# Altium project LPL_Control_board_Rev3.PrjPcb (part 1 of 2)
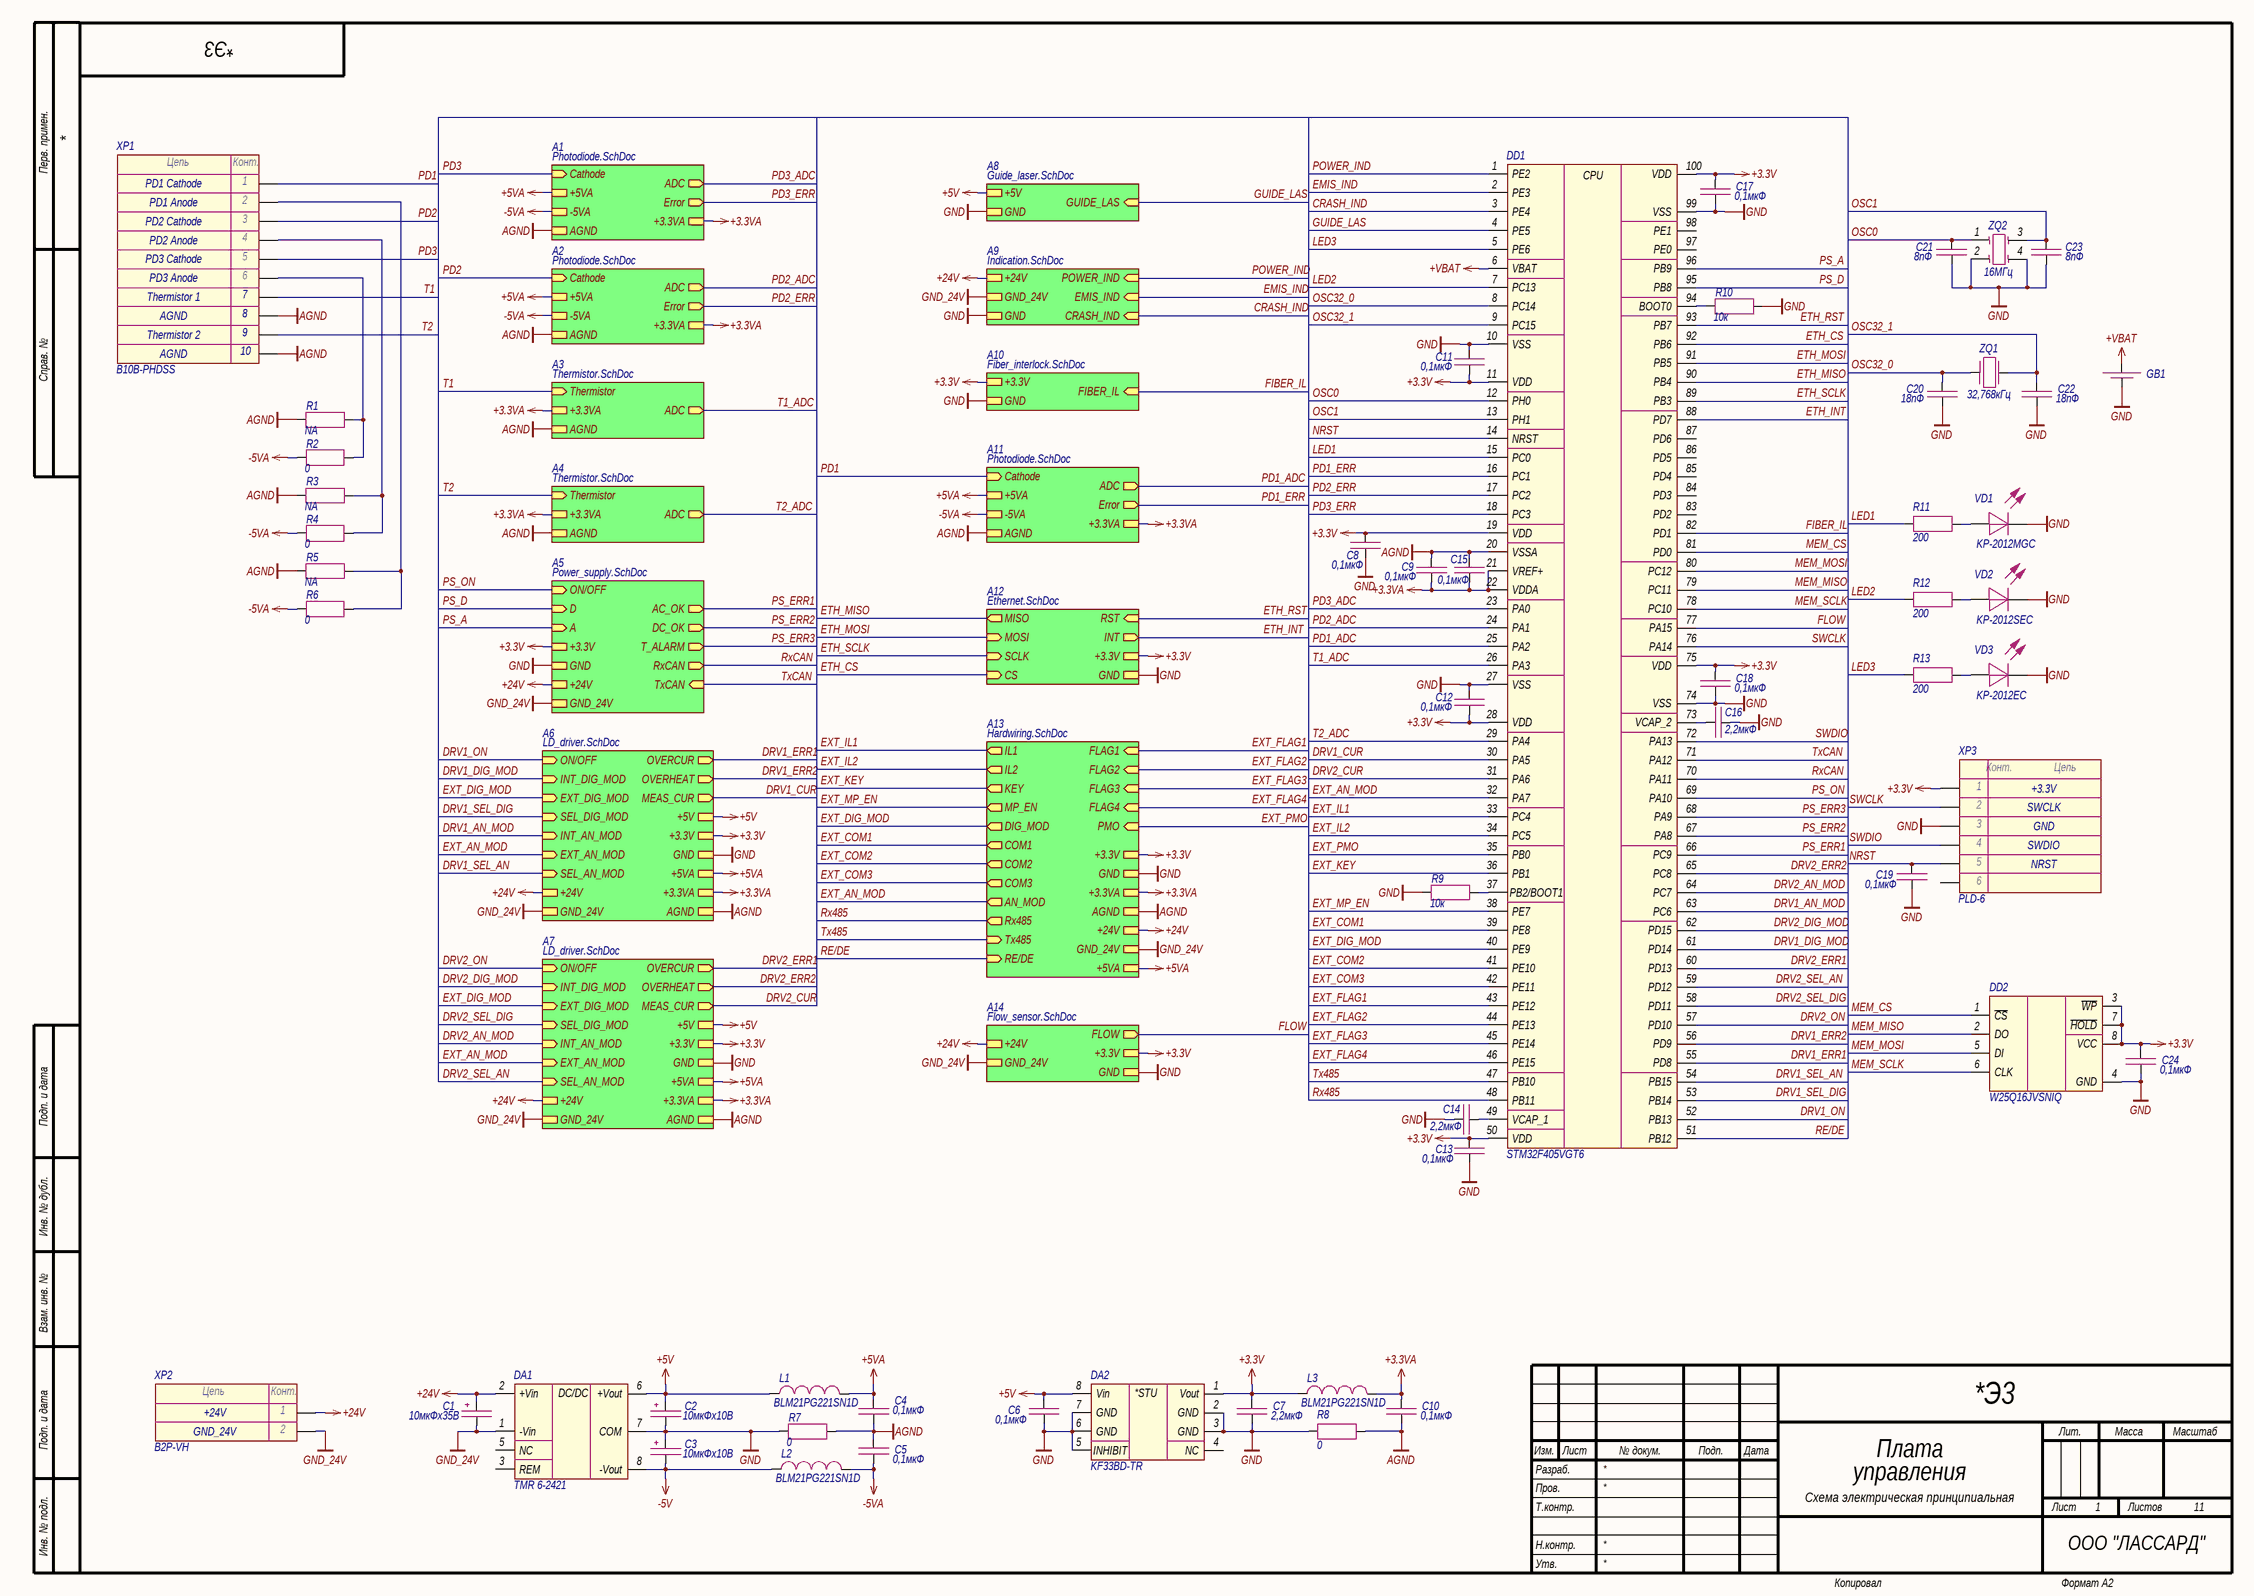
[diagram p0: Main.SchDoc]
11 sheets, 398 parts. Net scope: strictly hierarchical (ports join the sheet entries above them; power ports are local).
Board file: PCB1.PcbDoc
Sheets:
  Main.SchDoc
    A9 = Indication.SchDoc
    A13 = Hardwiring.SchDoc
    A12 = Ethernet.SchDoc
    A1 = Photodiode.SchDoc
    A3 = Thermistor.SchDoc
    A5 = Power_supply.SchDoc
    A6 = LD_driver.SchDoc
    A8 = Guide_laser.SchDoc
    A2 = Photodiode.SchDoc
    A4 = Thermistor.SchDoc
    A10 = Fiber_interlock.SchDoc
    A11 = Photodiode.SchDoc
    A14 = Flow_sensor.SchDoc
    A7 = LD_driver.SchDoc

## Sheet Main.SchDoc: Плата
size 594 x 420 mm; CompanyName: ООО "ЛАССАРД"; Address1: Address1; Address2: Address2; Address3: Address3; Address4: Address4; DocumentNumber: *Э3; SheetNumber: 1; SheetTotal: 11; Title2str: управления; DocumentType: Схема электрическая принципиальная

### Parts
C1  10мкФх35B  [CAP_C]
C2  10мкФх10B  [CAP_A]
C3  10мкФх10B  [CAP_A]
C4  0,1мкФ  [CAP_0603]
C5  0,1мкФ  [CAP_0603]
C6  0,1мкФ  [CAP_0603]
C7  2,2мкФ  [CAP_0603]
C8  0,1мкФ  [CAP_0603]
C9  0,1мкФ  [CAP_0603]
C10  0,1мкФ  [CAP_0603]
C11  0,1мкФ  [CAP_0603]
C12  0,1мкФ  [CAP_0603]
C13  0,1мкФ  [CAP_0603]
C14  2,2мкФ  [CAP_0603]
C15  0,1мкФ  [CAP_0603]
C16  2,2мкФ  [CAP_0603]
C17  0,1мкФ  [CAP_0603]
C18  0,1мкФ  [CAP_0603]
C19  0,1мкФ  [CAP_0603]
C20  18пФ  [CAP_0603]
C21  8пФ  [CAP_0603]
C22  18пФ  [CAP_0603]
C23  8пФ  [CAP_0603]
C24  0,1мкФ  [CAP_0603]
DA1  TMR 6-2421  [TMR3 (SIP-8)]
DA2  KF33BD-TR  [SOIC-8]
DD1  STM32F405VGT6  [LQFP-100]
DD2  W25Q16JVSNIQ  [SOIC-8]
GB1  DS1092-12-N8S  [DS1092-12-N8S]  (value not drawn)
L1  BLM21PG221SN1D  [IND_0805]
L2  BLM21PG221SN1D  [IND_0805]
L3  BLM21PG221SN1D  [IND_0805]
R1  NA  [RES_0603]
R2  0  [RES_0603]
R3  NA  [RES_0603]
R4  0  [RES_0603]
R5  NA  [RES_0603]
R6  0  [RES_0603]
R7  0  [RES_0805]
R8  0  [RES_0805]
R9  10к  [RES_0603]
R10  10к  [RES_0603]
R11  200  [RES_0603]
R12  200  [RES_0603]
R13  200  [RES_0603]
VD1  KP-2012MGC  [LED_0805]
VD2  KP-2012SEC  [LED_0805]
VD3  KP-2012EC  [LED_0805]
XP1  B10B-PHDSS  [B10B-PHDSS]
XP2  B2P-VH  [B2P-VH]
XP3  PLD-6  [PLD-6]
ZQ1  32,768кГц  [NX3215SA]
ZQ2  16МГц  [NX2520SA]

### Sub-sheets
A1 = Photodiode.SchDoc: Cathode (in), ADC (out), Error (out), AGND, +5VA, +3.3VA, -5VA
A2 = Photodiode.SchDoc: Cathode (in), ADC (out), Error (out), AGND, +5VA, +3.3VA, -5VA
A3 = Thermistor.SchDoc: Thermistor (in), +3.3VA, AGND, ADC (out)
A4 = Thermistor.SchDoc: Thermistor (in), +3.3VA, AGND, ADC (out)
A5 = Power_supply.SchDoc: ON/OFF (in), D (in), +3.3V, GND, +24V, GND_24V, AC_OK (out), DC_OK (out), RxCAN (out), TxCAN (in), T_ALARM (out), A (in)
A6 = LD_driver.SchDoc: +3.3V, GND, OVERCUR (out), OVERHEAT (out), +24V, GND_24V, ON/OFF (in), INT_DIG_MOD (in), INT_AN_MOD (in), EXT_DIG_MOD (in), SEL_DIG_MOD (in), EXT_AN_MOD (in), SEL_AN_MOD (in), MEAS_CUR (out), +5VA, +3.3VA, AGND, +5V
A7 = LD_driver.SchDoc: +3.3V, GND, OVERCUR (out), OVERHEAT (out), +24V, GND_24V, ON/OFF (in), INT_DIG_MOD (in), INT_AN_MOD (in), EXT_DIG_MOD (in), SEL_DIG_MOD (in), EXT_AN_MOD (in), SEL_AN_MOD (in), MEAS_CUR (out), +5VA, +3.3VA, AGND, +5V
A8 = Guide_laser.SchDoc: GUIDE_LAS (in), +5V, GND
A9 = Indication.SchDoc: GND_24V, +24V, CRASH_IND (in), POWER_IND (in), EMIS_IND (in), GND
A10 = Fiber_interlock.SchDoc: FIBER_IL (in), +3.3V, GND
A11 = Photodiode.SchDoc: Cathode (in), ADC (out), Error (out), AGND, +5VA, +3.3VA, -5VA
A12 = Ethernet.SchDoc: MISO (out), RST (in), MOSI (in), INT (out), SCLK (in), CS (in), +3.3V, GND
A13 = Hardwiring.SchDoc: IL1 (out), FLAG1 (in), Rx485 (out), Tx485 (in), IL2 (out), KEY (out), MP_EN (out), AN_MOD (out), FLAG2 (in), FLAG3 (in), FLAG4 (in), PMO (in), COM1 (out), COM2 (out), COM3 (out), DIG_MOD (out), RE/DE (in), +3.3VA, AGND, +3.3V, GND, GND_24V, +24V, +5VA
A14 = Flow_sensor.SchDoc: FLOW (out), +24V, GND_24V, +3.3V, GND

### Nets
+3.3V: C7.1 C8.1 C11.2 C12.2 C13.2 C17.1 C18.1 C24.1 DA2.1(Vout) DD1.11(VDD) DD1.19(VDD) DD1.28(VDD) DD1.50(VDD) DD1.75(VDD) DD1.100(VDD) DD2.3(~{WP}) DD2.7(~{HOLD}) DD2.8(VCC) L3.1 XP3.1 ; sheet A13/+3.3V, sheet A12/+3.3V, sheet A5/+3.3V, sheet A6/+3.3V, sheet A10/+3.3V, sheet A14/+3.3V, sheet A7/+3.3V
+3.3VA: C9.2 C10.1 C15.2 DD1.21(VREF+) DD1.22(VDDA) L3.2 ; sheet A13/+3.3VA, sheet A1/+3.3VA, sheet A3/+3.3VA, sheet A6/+3.3VA, sheet A2/+3.3VA, sheet A4/+3.3VA, sheet A11/+3.3VA, sheet A7/+3.3VA
+5V: C2.1 C6.1 DA1.6(+Vout) DA2.8(Vin) L1.1 ; sheet A6/+5V, sheet A8/+5V, sheet A7/+5V
+5VA: C4.1 L1.2 ; sheet A13/+5VA, sheet A1/+5VA, sheet A6/+5VA, sheet A2/+5VA, sheet A11/+5VA, sheet A7/+5VA
+24V: C1.1 DA1.2(+Vin) XP2.1 ; sheet A9/+24V, sheet A13/+24V, sheet A5/+24V, sheet A6/+24V, sheet A14/+24V, sheet A7/+24V
+VBAT: DD1.6(VBAT) GB1.2
-5V: C3.2 DA1.8(-Vout) L2.1
-5VA: C5.2 L2.2 R2.1 R4.1 R6.1 ; sheet A1/-5VA, sheet A2/-5VA, sheet A11/-5VA
AGND: C4.2 C5.1 C9.1 C10.2 C15.1 DD1.20(VSSA) R1.2 R3.2 R5.2 R7.2 R8.2 XP1.8 XP1.10 ; sheet A13/AGND, sheet A1/AGND, sheet A3/AGND, sheet A6/AGND, sheet A2/AGND, sheet A4/AGND, sheet A11/AGND, sheet A7/AGND
GND: C2.2 C3.1 C6.2 C7.2 C8.2 C11.1 C12.1 C13.1 C14.2 C16.2 C17.2 C18.2 C19.2 C20.2 C21.2 C22.2 C23.2 C24.2 DA1.7(COM) DA2.2(GND) DA2.3(GND) DA2.5(INHIBIT) DA2.6(GND) DA2.7(GND) DD1.10(VSS) DD1.27(VSS) DD1.74(VSS) DD1.99(VSS) DD2.4(GND) GB1.1 R7.1 R8.1 R9.2 R10.2 VD1.2(C) VD2.2(C) VD3.2(C) XP3.3 ZQ2.2 ZQ2.4 ; sheet A9/GND, sheet A13/GND, sheet A12/GND, sheet A5/GND, sheet A6/GND, sheet A8/GND, sheet A10/GND, sheet A14/GND, sheet A7/GND
GND_24V: C1.2 DA1.1(-Vin) XP2.2 ; sheet A9/GND_24V, sheet A13/GND_24V, sheet A5/GND_24V, sheet A6/GND_24V, sheet A14/GND_24V, sheet A7/GND_24V
CRASH_IND: DD1.3(PE4) ; sheet A9/CRASH_IND
DRV1_AN_MOD: DD1.63(PC6) ; sheet A6/INT_AN_MOD
DRV1_CUR: DD1.30(PA5) ; sheet A6/MEAS_CUR
DRV1_DIG_MOD: DD1.61(PD14) ; sheet A6/INT_DIG_MOD
DRV1_ERR1: DD1.55(PD8) ; sheet A6/OVERCUR
DRV1_ERR2: DD1.56(PD9) ; sheet A6/OVERHEAT
DRV1_ON: DD1.52(PB13) ; sheet A6/ON/OFF
DRV1_SEL_AN: DD1.54(PB15) ; sheet A6/SEL_AN_MOD
DRV1_SEL_DIG: DD1.53(PB14) ; sheet A6/SEL_DIG_MOD
DRV2_AN_MOD: DD1.64(PC7) ; sheet A7/INT_AN_MOD
DRV2_CUR: DD1.31(PA6) ; sheet A7/MEAS_CUR
DRV2_DIG_MOD: DD1.62(PD15) ; sheet A7/INT_DIG_MOD
DRV2_ERR1: DD1.60(PD13) ; sheet A7/OVERCUR
DRV2_ERR2: DD1.65(PC8) ; sheet A7/OVERHEAT
DRV2_ON: DD1.57(PD10) ; sheet A7/ON/OFF
DRV2_SEL_AN: DD1.59(PD12) ; sheet A7/SEL_AN_MOD
DRV2_SEL_DIG: DD1.58(PD11) ; sheet A7/SEL_DIG_MOD
EMIS_IND: DD1.2(PE3) ; sheet A9/EMIS_IND
ETH_CS: DD1.92(PB6) ; sheet A12/CS
ETH_INT: DD1.88(PD7) ; sheet A12/INT
ETH_MISO: DD1.90(PB4) ; sheet A12/MISO
ETH_MOSI: DD1.91(PB5) ; sheet A12/MOSI
ETH_RST: DD1.93(PB7) ; sheet A12/RST
ETH_SCLK: DD1.89(PB3) ; sheet A12/SCLK
EXT_AN_MOD: DD1.32(PA7) ; sheet A13/AN_MOD, sheet A6/EXT_AN_MOD, sheet A7/EXT_AN_MOD
EXT_COM1: DD1.39(PE8) ; sheet A13/COM1
EXT_COM2: DD1.41(PE10) ; sheet A13/COM2
EXT_COM3: DD1.42(PE11) ; sheet A13/COM3
EXT_DIG_MOD: DD1.40(PE9) ; sheet A13/DIG_MOD, sheet A6/EXT_DIG_MOD, sheet A7/EXT_DIG_MOD
EXT_FLAG1: DD1.43(PE12) ; sheet A13/FLAG1
EXT_FLAG2: DD1.44(PE13) ; sheet A13/FLAG2
EXT_FLAG3: DD1.45(PE14) ; sheet A13/FLAG3
EXT_FLAG4: DD1.46(PE15) ; sheet A13/FLAG4
EXT_IL1: DD1.33(PC4) ; sheet A13/IL1
EXT_IL2: DD1.34(PC5) ; sheet A13/IL2
EXT_KEY: DD1.36(PB1) ; sheet A13/KEY
EXT_MP_EN: DD1.38(PE7) ; sheet A13/MP_EN
EXT_PMO: DD1.35(PB0) ; sheet A13/PMO
FIBER_IL: DD1.82(PD1) ; sheet A10/FIBER_IL
FLOW: DD1.77(PA15) ; sheet A14/FLOW
GUIDE_LAS: DD1.4(PE5) ; sheet A8/GUIDE_LAS
LED1: DD1.15(PC0) R11.1
LED2: DD1.7(PC13) R12.1
LED3: DD1.5(PE6) R13.1
MEM_CS: DD1.81(PD0) DD2.1(~{CS})
MEM_MISO: DD1.79(PC11) DD2.2(DO)
MEM_MOSI: DD1.80(PC12) DD2.5(DI)
MEM_SCLK: DD1.78(PC10) DD2.6(CLK)
NRST: C19.1 DD1.14(NRST) XP3.5
OSC0: C21.1 DD1.12(PH0) ZQ2.1
OSC1: C23.1 DD1.13(PH1) ZQ2.3
OSC32_0: C20.1 DD1.8(PC14) ZQ1.1
OSC32_1: C22.1 DD1.9(PC15) ZQ1.2
PD1: XP1.1 ; sheet A11/Cathode
PD1_ADC: DD1.25(PA2) ; sheet A11/ADC
PD1_ERR: DD1.16(PC1) ; sheet A11/Error
PD2: XP1.3 ; sheet A2/Cathode
PD2_ADC: DD1.24(PA1) ; sheet A2/ADC
PD2_ERR: DD1.17(PC2) ; sheet A2/Error
PD3: XP1.5 ; sheet A1/Cathode
PD3_ADC: DD1.23(PA0) ; sheet A1/ADC
PD3_ERR: DD1.18(PC3) ; sheet A1/Error
POWER_IND: DD1.1(PE2) ; sheet A9/POWER_IND
PS_A: DD1.96(PB9) ; sheet A5/A
PS_D: DD1.95(PB8) ; sheet A5/D
PS_ERR1: DD1.66(PC9) ; sheet A5/AC_OK
PS_ERR2: DD1.67(PA8) ; sheet A5/DC_OK
PS_ERR3: DD1.68(PA9) ; sheet A5/T_ALARM
PS_ON: DD1.69(PA10) ; sheet A5/ON/OFF
RE/DE: DD1.51(PB12) ; sheet A13/RE/DE
Rx485: DD1.48(PB11) ; sheet A13/Rx485
RxCAN: DD1.70(PA11) ; sheet A5/RxCAN
SWCLK: DD1.76(PA14) XP3.2
SWDIO: DD1.72(PA13) XP3.4
T1: XP1.7 ; sheet A3/Thermistor
T1_ADC: DD1.26(PA3) ; sheet A3/ADC
T2: XP1.9 ; sheet A4/Thermistor
T2_ADC: DD1.29(PA4) ; sheet A4/ADC
Tx485: DD1.47(PB10) ; sheet A13/Tx485
TxCAN: DD1.71(PA12) ; sheet A5/TxCAN
NetC14_1: C14.1 DD1.49(VCAP_1)
NetC16_1: C16.1 DD1.73(VCAP_2)
NetDD1_37: DD1.37(PB2/BOOT1) R9.1
NetDD1_94: DD1.94(BOOT0) R10.1
NetR1_1: R1.1 R2.2 XP1.6
NetR3_1: R3.1 R4.2 XP1.4
NetR5_1: R5.1 R6.2 XP1.2
NetR11_2: R11.2 VD1.1(A)
NetR12_2: R12.2 VD2.1(A)
NetR13_2: R13.2 VD3.1(A)

Not connected (* = marked no-connect by the designer): DA1 3(REM) 5(NC); DA2 4(NC); DD1 83(PD2) 84(PD3) 85(PD4) 86(PD5) 87(PD6) 97(PE0) 98(PE1); XP3 6

### Notes on the sheet
- PD1 Cathode
- PD1 Anode
- PD2 Cathode
- PD2 Anode
- PD3 Cathode
- Thermistor 1
- AGND
- PD3 Anode
- Thermistor 2
- +3.3V
- SWCLK
- GND
- SWDIO
- NRST
- +24V
- GND_24V
- Перв. примен.
- Справ. №
- Подп. и дата
- Инв. № дубл.
- Взам. инв. №
- Разраб.
- Изм.
- Лист
- № докум.
- Подп.
- Дата
- Лит.
- Масса
- Масштаб
- Пров.
- Т.контр.
- Листов
- Инв. № подл.
- Утв.
- Н.контр.
- Копировал
- Формат А2
- (in symbol Connector-2) Цепь; Конт.
- (in symbol Connector-10) Цепь; Конт.
- (in symbol KFXXBD-TR) *STU
- (in symbol STM32F405VG) CPU
- (in symbol TMR3 Dual) DC/DC
- (in symbol TMR3) DC/DC

### Library data of the parts
C1 = Capacitor_Polar: Model: TECAP, 10 мкФ, 35 В, тип C, 10%; Value: 10мкФх35B; Document: *; Manufacturer: *
C2 C3 = Capacitor_Polar: Model: TECAP, 10 мкФ, 10 В, тип A, 10%; Value: 10мкФх10B; Document: *; Manufacturer: *
C4-C6 C8-C13 C15 C17-C19 C24 = Capacitor: Manufacturer: Murata; Model: GRM188R71H104KA93D; Value: 0,1мкФ; Document: *
C7 C14 C16 = Capacitor: Manufacturer: Murata; Model: GRM188R61H225KE11D; Value: 2,2мкФ; Document: *
C20 C22 = Capacitor: Manufacturer: Murata; Model: GRM1885C1H180FA01D; Value: 18пФ; Document: *
C21 C23 = Capacitor: Manufacturer: Yageo; Model: CC0603CRNPO9BN8R0; Value: 8пФ; Document: *
DA1 = TMR3 Dual: Manufacturer: Traco Power; Model: TMR 6-2421; Document: *
DA2 = KFXXBD-TR: Manufacturer: STMicroelectronics; Model: KF33BD-TR; Document: *
DD1 = STM32F405VG: Manufacturer: STMicroelectronics; Model: STM32F405VGT6; Document: *
DD2 = W25Q: Manufacturer: Winbond; Model: W25Q16JVSNIQ; Document: *
GB1 = Accumulator: Manufacturer: Connfly; Model: DS1092-12-N8S; Document: *
L1-L3 = Inductor: Manufacturer: Murata; Value: *; Model: BLM21PG221SN1D; Document: *
R1 R3 R5 = Resistor: Value: NA; Model: *; Document: *; Manufacturer: *
R2 R4 R6 = Resistor: Manufacturer: Yageo; Model: RC0603FR-070RL; Value: 0; Document: *
R7 R8 = Resistor: Manufacturer: Yageo; Model: RC0805FR-070RL; Value: 0; Document: *
R9 R10 = Resistor: Manufacturer: Yageo; Model: RC0603FR-0710KL; Value: 10к; Document: *
R11-R13 = Resistor: Manufacturer: Yageo; Model: RC0603FR-07200RL; Value: 200; Document: *
VD1-VD3 = LED: Manufacturer: Kingbright; Document: *
  VD1: Model: KP-2012MGC
  VD2: Model: KP-2012SEC
  VD3: Model: KP-2012EC
XP1 = Connector-10: Manufacturer: JST; Model: B10B-PHDSS; Document: *
XP2 = Connector-2: Manufacturer: JST; Model: B2P-VH; Document: *
XP3 = Connector-6: Manufacturer: Connfly; Model: PLD-6; Document: *
ZQ1 = Quartz_Resonator: Manufacturer: NDK; Model: NX3215SA- 32.768K-STD-MUA-8; Value: 32,768кГц; Document: *
ZQ2 = Quartz_Resonator_4-pin: Manufacturer: NDK; Model: NX2520SA-16MHZ-STD-CSW-5; Value: 16МГц; Document: *

## Sheet Indication.SchDoc
size 420 x 297 mm; Address1: Address1; Address2: Address2; Address3: Address3; Address4: Address4; DocumentNumber: *Э3; SheetNumber: 7; SheetTotal: 11; DocumentType: Схема электрическая *
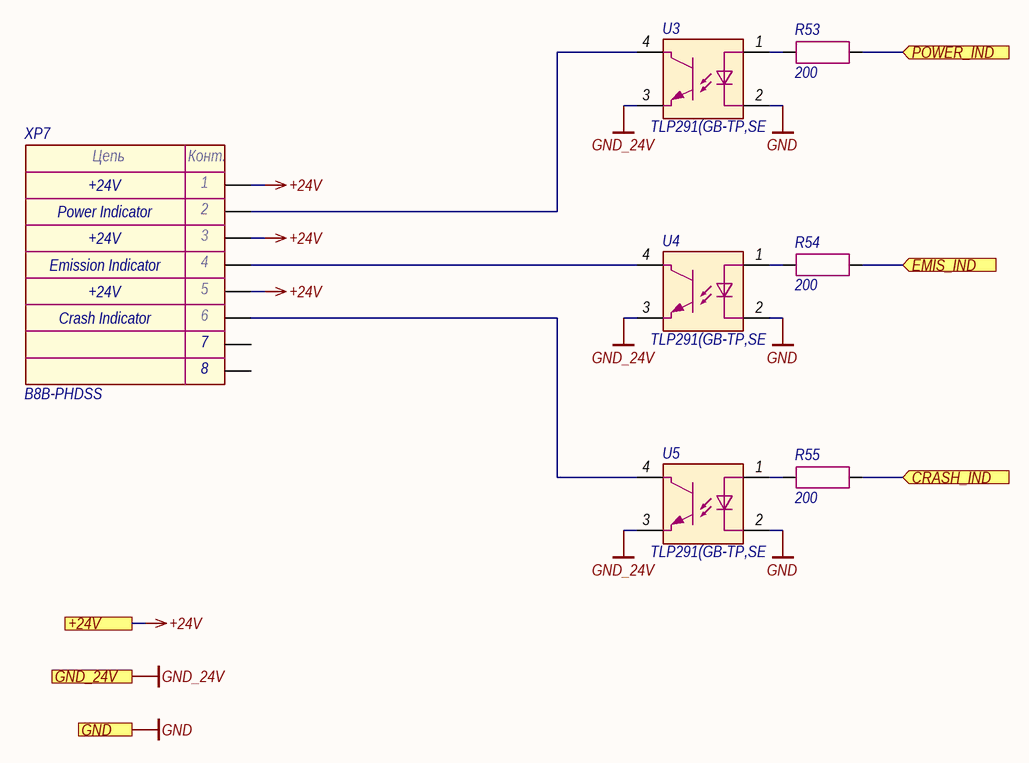
[diagram p1: Indication.SchDoc]

### Parts
R53  200  [RES_0603]
R54  200  [RES_0603]
R55  200  [RES_0603]
U3  TLP291(GB-TP,SE  [11-3C1]
U4  TLP291(GB-TP,SE  [11-3C1]
U5  TLP291(GB-TP,SE  [11-3C1]
XP7  B8B-PHDSS  [B8B-PHDSS]

### Ports
+24V (see Main[2A], Flow_sensor[2C], Hardwiring[3C], LD_driver[1D], Power_supply[1D]), CRASH_IND (in, see Main[3A]), EMIS_IND (in, see Main[3A]), GND (see Main[2A], Ethernet[3D], Fiber_interlock[2C], Flow_sensor[2C], Guide_laser[1C], Hardwiring[3D], LD_driver[1D], Power_supply[1D]), GND_24V (see Main[2A], Flow_sensor[2C], Hardwiring[3C], LD_driver[1D], Power_supply[1D]), POWER_IND (in, see Main[3A])

### Nets
+24V: XP7.1 XP7.3 XP7.5 ; port +24V
GND: U3.2 U4.2 U5.2 ; port GND
GND_24V: U3.3 U4.3 U5.3 ; port GND_24V
CRASH_IND: R55.2 ; port CRASH_IND
EMIS_IND: R54.2 ; port EMIS_IND
POWER_IND: R53.2 ; port POWER_IND
NetR53_1: R53.1 U3.1
NetR54_1: R54.1 U4.1
NetR55_1: R55.1 U5.1
NetU3_4: U3.4 XP7.2
NetU4_4: U4.4 XP7.4
NetU5_4: U5.4 XP7.6

Not connected (* = marked no-connect by the designer): XP7 7 8

### Notes on the sheet
- Power Indicator
- +24V
- (near XP7) Emission Indicator
- Crash Indicator
- Подп. и дата
- Инв. № дубл.
- Взам. инв. №
- Инв. № подл.
- Изм.
- Лист
- № докум.
- Подп.
- Дата
- Копировал
- Формат А3
- (in symbol Connector-8) Цепь; Конт.

### Library data of the parts
R53-R55 = Resistor: as R11 on sheet Main; Value: 200; Document: *
U3-U5 = TLP291: Manufacturer: Toshiba; Model: TLP291(GB-TP,SE; Document: *
XP7 = Connector-8: Manufacturer: JST; Model: B8B-PHDSS; Document: *

## Sheet Hardwiring.SchDoc
size 594 x 420 mm; Address1: Address1; Address2: Address2; Address3: Address3; Address4: Address4; DocumentNumber: *Э3; SheetNumber: 10; SheetTotal: 11; DocumentType: Схема электрическая *
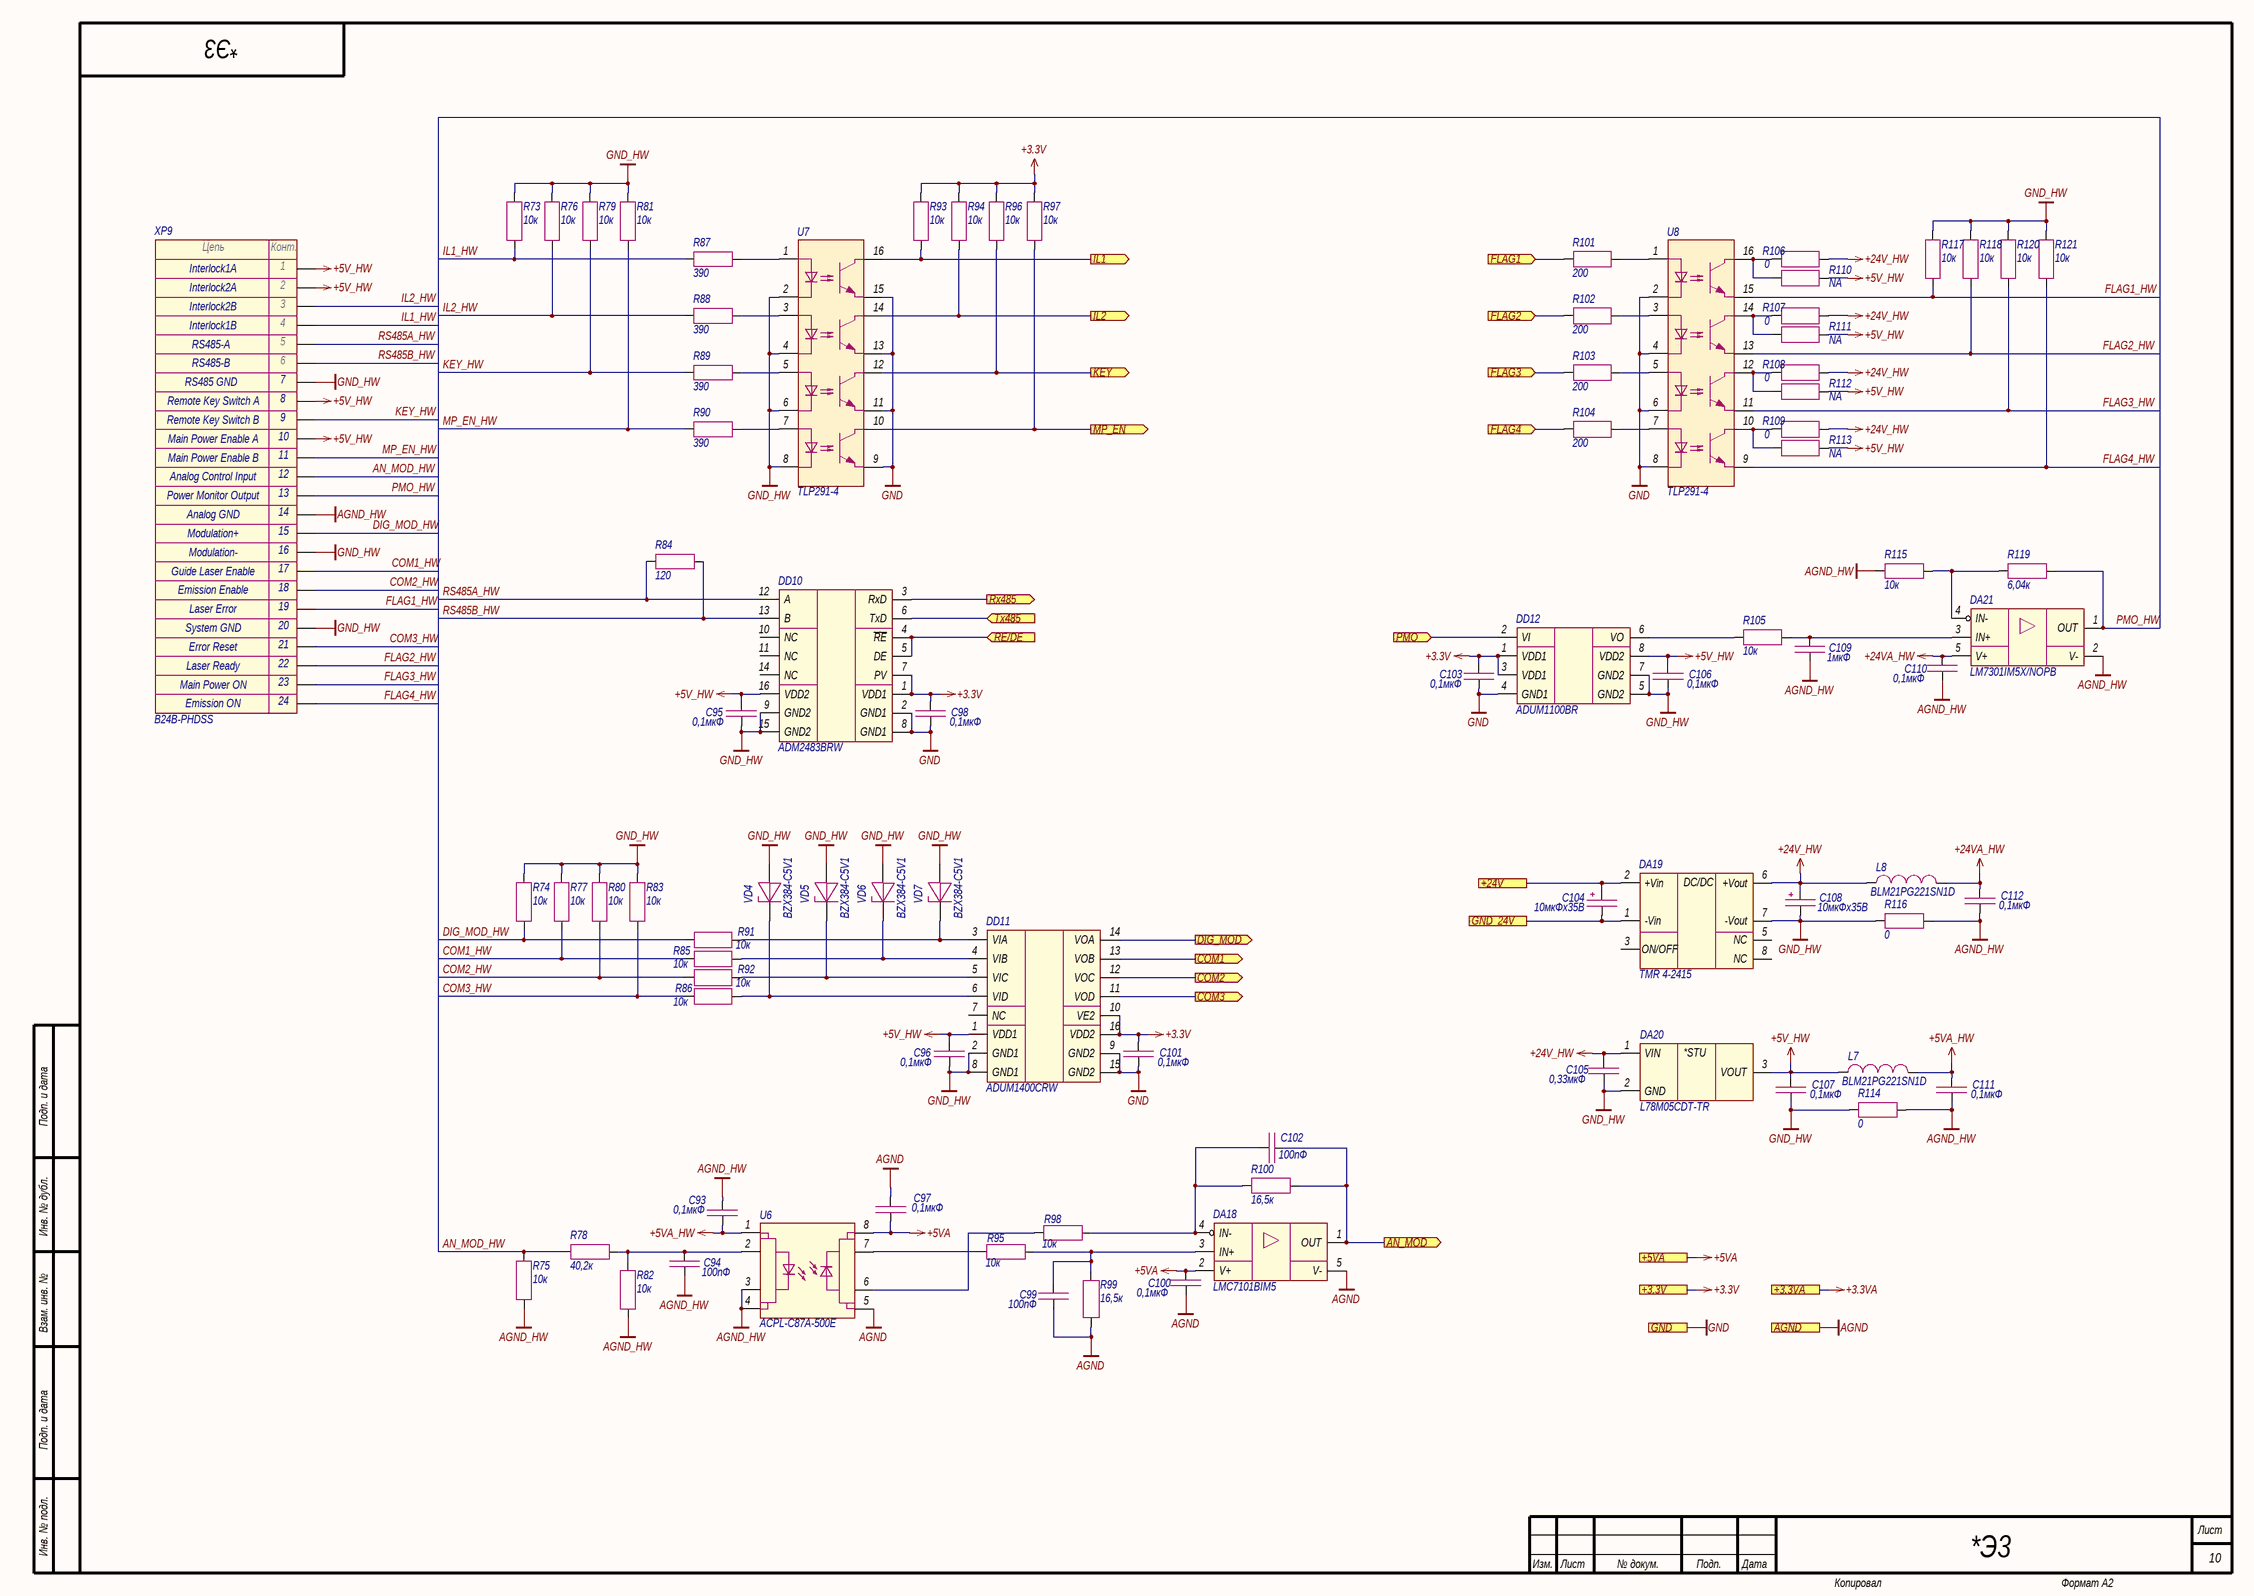
[diagram p2: Hardwiring.SchDoc]

### Parts
C93  0,1мкФ  [CAP_0603]
C94  100пФ  [CAP_0603]
C95  0,1мкФ  [CAP_0603]
C96  0,1мкФ  [CAP_0603]
C97  0,1мкФ  [CAP_0603]
C98  0,1мкФ  [CAP_0603]
C99  100пФ  [CAP_0603]
C100  0,1мкФ  [CAP_0603]
C101  0,1мкФ  [CAP_0603]
C102  100пФ  [CAP_0603]
C103  0,1мкФ  [CAP_0603]
C104  10мкФх35B  [CAP_C]
C105  0,33мкФ  [CAP_0805]
C106  0,1мкФ  [CAP_0603]
C107  0,1мкФ  [CAP_0603]
C108  10мкФх35B  [CAP_C]
C109  1мкФ  [CAP_0603]
C110  0,1мкФ  [CAP_0603]
C111  0,1мкФ  [CAP_0603]
C112  0,1мкФ  [CAP_0603]
DA18  LMC7101BIM5  [SOT-23-5]
DA19  TMR 4-2415  [TMR4 (SIP-8)]
DA20  L78M05CDT-TR  [TO-252]
DA21  LM7301IM5X/NOPB  [SOT-23-5]
DD10  ADM2483BRW  [SOIC-16W]
DD11  ADUM1400CRW  [SOIC-16W]
DD12  ADUM1100BR  [SOIC-8]
L7  BLM21PG221SN1D  [IND_0805]
L8  BLM21PG221SN1D  [IND_0805]
R73  10к  [RES_0603]
R74  10к  [RES_0603]
R75  10к  [RES_0603]
R76  10к  [RES_0603]
R77  10к  [RES_0603]
R78  40,2к  [RES_0603]
R79  10к  [RES_0603]
R80  10к  [RES_0603]
R81  10к  [RES_0603]
R82  10к  [RES_0603]
R83  10к  [RES_0603]
R84  120  [RES_0805]
R85  10к  [RES_0603]
R86  10к  [RES_0603]
R87  390  [RES_0603]
R88  390  [RES_0603]
R89  390  [RES_0603]
R90  390  [RES_0603]
R91  10к  [RES_0603]
R92  10к  [RES_0603]
R93  10к  [RES_0603]
R94  10к  [RES_0603]
R95  10к  [RES_0603]
R96  10к  [RES_0603]
R97  10к  [RES_0603]
R98  10к  [RES_0603]
R99  16,5к  [RES_0603]
R100  16,5к  [RES_0603]
R101  200  [RES_0603]
R102  200  [RES_0603]
R103  200  [RES_0603]
R104  200  [RES_0603]
R105  10к  [RES_0603]
R106  0  [RES_0603]
R107  0  [RES_0603]
R108  0  [RES_0603]
R109  0  [RES_0603]
R110  NA  [RES_0603]
R111  NA  [RES_0603]
R112  NA  [RES_0603]
R113  NA  [RES_0603]
R114  0  [RES_0805]
R115  10к  [RES_0603]
R116  0  [RES_0805]
R117  10к  [RES_0603]
R118  10к  [RES_0603]
R119  6,04к  [RES_0603]
R120  10к  [RES_0603]
R121  10к  [RES_0603]
U6  ACPL-C87A-500E  [SSO-8]
U7  TLP291-4  [SOP-16]
U8  TLP291-4  [SOP-16]
VD4  BZX384-C5V1  [SOD-323]
VD5  BZX384-C5V1  [SOD-323]
VD6  BZX384-C5V1  [SOD-323]
VD7  BZX384-C5V1  [SOD-323]
XP9  B24B-PHDSS  [B24B-PHDSS]

### Ports
+3.3V (see Main[3C], Ethernet[3D], Fiber_interlock[2C], Flow_sensor[2C], LD_driver[1D], Power_supply[1D]), +3.3VA (see Main[3C], LD_driver[1D], Photodiode[1C], Thermistor[2C]), +5VA (see Main[3C], LD_driver[1D], Photodiode[1C]), +24V (see Main[3C], Flow_sensor[2C], Indication[1C], LD_driver[1D], Power_supply[1D]), AGND (see Main[3C], LD_driver[1D], Photodiode[1C], Thermistor[2C]), AN_MOD (out, see Main[2C]), COM1 (out, see Main[2C]), COM2 (out, see Main[2C]), COM3 (out, see Main[2C]), DIG_MOD (out, see Main[2C]), FLAG1 (in, see Main[3B]), FLAG2 (in, see Main[3B]), FLAG3 (in, see Main[3B]), FLAG4 (in, see Main[3C]), GND (see Main[3C], Ethernet[3D], Fiber_interlock[2C], Flow_sensor[2C], Guide_laser[1C], Indication[1C], LD_driver[1D], Power_supply[1D]), GND_24V (see Main[3C], Flow_sensor[2C], Indication[1C], LD_driver[1D], Power_supply[1D]), IL1 (out, see Main[2B]), IL2 (out, see Main[2B]), KEY (out, see Main[2B]), MP_EN (out, see Main[2C]), PMO (in, see Main[3C]), RE/DE (in, see Main[2C]), Rx485 (out, see Main[2C]), Tx485 (in, see Main[2C])

### Nets
+3.3V: C98.1 C101.1 C103.1 DD10.1(VDD1) DD10.7(PV) DD11.10(VE2) DD11.16(VDD2) DD12.1(VDD1) DD12.3(VDD1) R93.1 R94.1 R96.1 R97.1 ; port +3.3V
+5V_HW: C95.1 C96.1 C106.1 C107.1 DA20.3(VOUT) DD10.16(VDD2) DD11.1(VDD1) DD12.8(VDD2) L7.1 R110.2 R111.2 R112.2 R113.2 XP9.1 XP9.2 XP9.8 XP9.10
+5VA: C97.1 C100.1 DA18.2(V+) U6.8(VDD2) ; port +5VA
+5VA_HW: C93.1 C111.1 L7.2 U6.1(VDD1)
+24V: C104.1 DA19.2(+Vin) ; port +24V
+24V_HW: C105.2 C108.1 DA19.6(+Vout) DA20.1(VIN) L8.1 R106.2 R107.2 R108.2 R109.2
+24VA_HW: C110.1 C112.1 DA21.5(V+) L8.2
AGND: C97.2 C99.2 C100.2 DA18.5(V-) R99.2 U6.5(GND2) ; port AGND
AGND_HW: C93.2 C94.1 C109.2 C110.2 C111.2 C112.2 DA21.2(V-) R75.2 R82.2 R114.2 R115.1 R116.2 U6.3(SHDN) U6.4(GND1) XP9.14
GND: C98.2 C101.2 C103.2 DD10.2(GND1) DD10.8(GND1) DD11.9(GND2) DD11.15(GND2) DD12.4(GND1) U7.9 U7.11 U7.13 U7.15 U8.2 U8.4 U8.6 U8.8 ; port GND
GND_24V: C104.2 DA19.1(-Vin) ; port GND_24V
GND_HW: C95.2 C96.2 C105.1 C106.2 C107.2 C108.2 DA19.7(-Vout) DA20.2(GND) DD10.9(GND2) DD10.15(GND2) DD11.2(GND1) DD11.8(GND1) DD12.5(GND2) DD12.7(GND2) R73.1 R74.1 R76.1 R77.1 R79.1 R80.1 R81.1 R83.1 R114.1 R116.1 R117.1 R118.1 R120.1 R121.1 U7.2 U7.4 U7.6 U7.8 VD4.2(A) VD5.2(A) VD6.2(A) VD7.2(A) XP9.7 XP9.16 XP9.20
AN_MOD_HW: R75.1 R78.2 XP9.12
COM1_HW: R77.2 R85.1 XP9.17
COM2_HW: R80.2 R92.1 XP9.18
COM3_HW: R83.2 R86.1 XP9.21
DIG_MOD_HW: R74.2 R91.1 XP9.15
EXT_AN_MOD: C102.2 DA18.1(OUT) R100.1 ; port AN_MOD
EXT_COM1: DD11.13(VOB) ; port COM1
EXT_COM2: DD11.12(VOC) ; port COM2
EXT_COM3: DD11.11(VOD) ; port COM3
EXT_DIG_MOD: DD11.14(VOA) ; port DIG_MOD
EXT_FLAG1: R101.2 ; port FLAG1
EXT_FLAG2: R102.2 ; port FLAG2
EXT_FLAG3: R103.2 ; port FLAG3
EXT_FLAG4: R104.2 ; port FLAG4
EXT_IL1: R93.2 U7.16 ; port IL1
EXT_IL2: R94.2 U7.14 ; port IL2
EXT_KEY: R96.2 U7.12 ; port KEY
EXT_MP_EN: R97.2 U7.10 ; port MP_EN
EXT_PMO: DD12.2(VI) ; port PMO
FLAG1_HW: R117.2 U8.15 XP9.19
FLAG2_HW: R118.2 U8.13 XP9.22
FLAG3_HW: R120.2 U8.11 XP9.23
FLAG4_HW: R121.2 U8.9 XP9.24
IL1_HW: R73.2 R87.1 XP9.4
IL2_HW: R76.2 R88.1 XP9.3
KEY_HW: R79.2 R89.1 XP9.9
MP_EN_HW: R81.2 R90.1 XP9.11
PMO_HW: DA21.1(OUT) R119.2 XP9.13
RE/DE: DD10.4(~{RE}) DD10.5(DE) ; port RE/DE
RS485A_HW: DD10.12(A) R84.1 XP9.5
RS485B_HW: DD10.13(B) R84.2 XP9.6
Rx485: DD10.3(RxD) ; port Rx485
Tx485: DD10.6(TxD) ; port Tx485
NetC94_2: C94.2 R78.1 R82.1 U6.2(VIN)
NetC99_1: C99.1 DA18.3(IN+) R95.2 R99.1
NetC102_1: C102.1 DA18.4(IN-) R98.2 R100.2
NetC109_1: C109.1 DA21.3(IN+) R105.2
NetDA21_4: DA21.4(IN-) R115.2 R119.1
NetDD11_3: DD11.3(VIA) R91.2 VD7.1(K)
NetDD11_4: DD11.4(VIB) R85.2 VD6.1(K)
NetDD11_5: DD11.5(VIC) R92.2 VD5.1(K)
NetDD11_6: DD11.6(VID) R86.2 VD4.1(K)
NetDD12_6: DD12.6(VO) R105.1
NetR87_2: R87.2 U7.1
NetR88_2: R88.2 U7.3
NetR89_2: R89.2 U7.5
NetR90_2: R90.2 U7.7
NetR95_1: R95.1 U6.7(VOUT+)
NetR98_1: R98.1 U6.6(VOUT-)
NetR101_1: R101.1 U8.1
NetR102_1: R102.1 U8.3
NetR103_1: R103.1 U8.5
NetR104_1: R104.1 U8.7
NetR106_1: R106.1 R110.1 U8.16
NetR107_1: R107.1 R111.1 U8.14
NetR108_1: R108.1 R112.1 U8.12
NetR109_1: R109.1 R113.1 U8.10

Not connected (* = marked no-connect by the designer): DA19 3(ON/OFF) 5(NC) 8(NC); DD10 10(NC) 11(NC) 14(NC); DD11 7(NC)

### Notes on the sheet
- Interlock1A
- Interlock2A
- Interlock2B
- RS485-A
- RS485-B
- Interlock1B
- RS485 GND
- (near XP9) Remote Key Switch A
- (near XP9) Remote Key Switch B
- (near XP9) Main Power Enable A
- (near XP9) Main Power Enable B
- (near XP9) Analog Control Input
- (near XP9) Power Monitor Output
- Analog GND
- Modulation+
- Modulation-
- (near XP9) Guide Laser Enable
- (near XP9) Emission Enable
- System GND
- Error Reset
- Laser Error
- Main Power ON
- Emission ON
- Laser Ready
- Подп. и дата
- Инв. № дубл.
- Взам. инв. №
- Инв. № подл.
- Изм.
- Лист
- № докум.
- Подп.
- Дата
- Копировал
- Формат А2
- (in symbol Connector-24) Цепь; Конт.
- (in symbol L78M) *STU
- (in symbol TMR4) DC/DC

### Library data of the parts
C93 C95-C98 C100 C101 C103 C106 C107 C110-C112 = Capacitor: as C4 on sheet Main; Value: 0,1мкФ; Document: *
C94 C99 C102 = Capacitor: Manufacturer: Murata; Model: GRM1885C1H101JA01D; Value: 100пФ; Document: *
C104 C108 = Capacitor_Polar: Model: TECAP, 10 мкФ, 35 В, тип C, 10%; Value: 10мкФх35B; Document: *; Manufacturer: *
C105 = Capacitor: Manufacturer: Murata; Model: GRM219R71H334KA88D; Value: 0,33мкФ; Document: *
C109 = Capacitor: Manufacturer: Murata; Model: GRM188R61H105KAALD; Value: 1мкФ; Document: *
DA18 = LMC7101: Manufacturer: Texas Instruments; Model: LMC7101BIM5; Document: *
DA19 = TMR4: Manufacturer: Traco Power; Model: TMR 4-2415; Document: *
DA20 = L78M: Manufacturer: STMicroelectronics; Model: L78M05CDT-TR; Document: *
DA21 = LM7301IM5: Manufacturer: Texas Instruments; Model: LM7301IM5X/NOPB; Document: *
DD10 = ADM2483BRW: Manufacturer: Analog Devices; Model: ADM2483BRW; Document: *
DD11 = ADUM1400: Manufacturer: Analog Devices; Model: ADUM1400CRW; Document: *
DD12 = ADUM1100: Manufacturer: Analog Devices; Model: ADUM1100BR; Document: *
L7 L8 = Inductor: Manufacturer: Murata; Value: *; Model: BLM21PG221SN1D; Document: *
R73-R77 R79-R83 R85 R86 R91-R98 R105 R115 R117 R118 R120 R121 = Resistor: as R9 on sheet Main; Value: 10к; Document: *
R78 = Resistor: Manufacturer: Yageo; Model: RC0603FR-0740K2L; Value: 40,2к; Document: *
R84 = Resistor: Manufacturer: Yageo; Model: RC0805FR-07120RL; Value: 120; Document: *
R87-R90 = Resistor: Manufacturer: Yageo; Model: RC0603FR-07390RL; Value: 390; Document: *
R99 R100 = Resistor: Manufacturer: Yageo; Model: RC0603FR-0716K5L; Value: 16,5к; Document: *
R101-R104 = Resistor: as R11 on sheet Main; Value: 200; Document: *
R106-R109 = Resistor: as R2 on sheet Main; Value: 0; Document: *
R110-R113 = Resistor: Value: NA; Model: *; Document: *; Manufacturer: *
R114 R116 = Resistor: as R7 on sheet Main; Value: 0; Document: *
R119 = Resistor: Manufacturer: Yageo; Model: RC0603FR-076K04L; Value: 6,04к; Document: *
U6 = ACPL-C87: Manufacturer: Broadcom; Model: ACPL-C87A-500E
U7 U8 = TLP281-4: Manufacturer: Toshiba; Model: TLP291-4; Document: *
VD4-VD7 = Diode_Zener: Manufacturer: Nexperia; Model: BZX384-C5V1; Document: *
XP9 = Connector-24: Manufacturer: JST; Model: B24B-PHDSS; Document: *

## Sheet Ethernet.SchDoc
size 420 x 297 mm; Address1: Address1; Address2: Address2; Address3: Address3; Address4: Address4; DocumentNumber: *Э3; SheetNumber: 9; SheetTotal: 11; DocumentType: Схема электрическая *
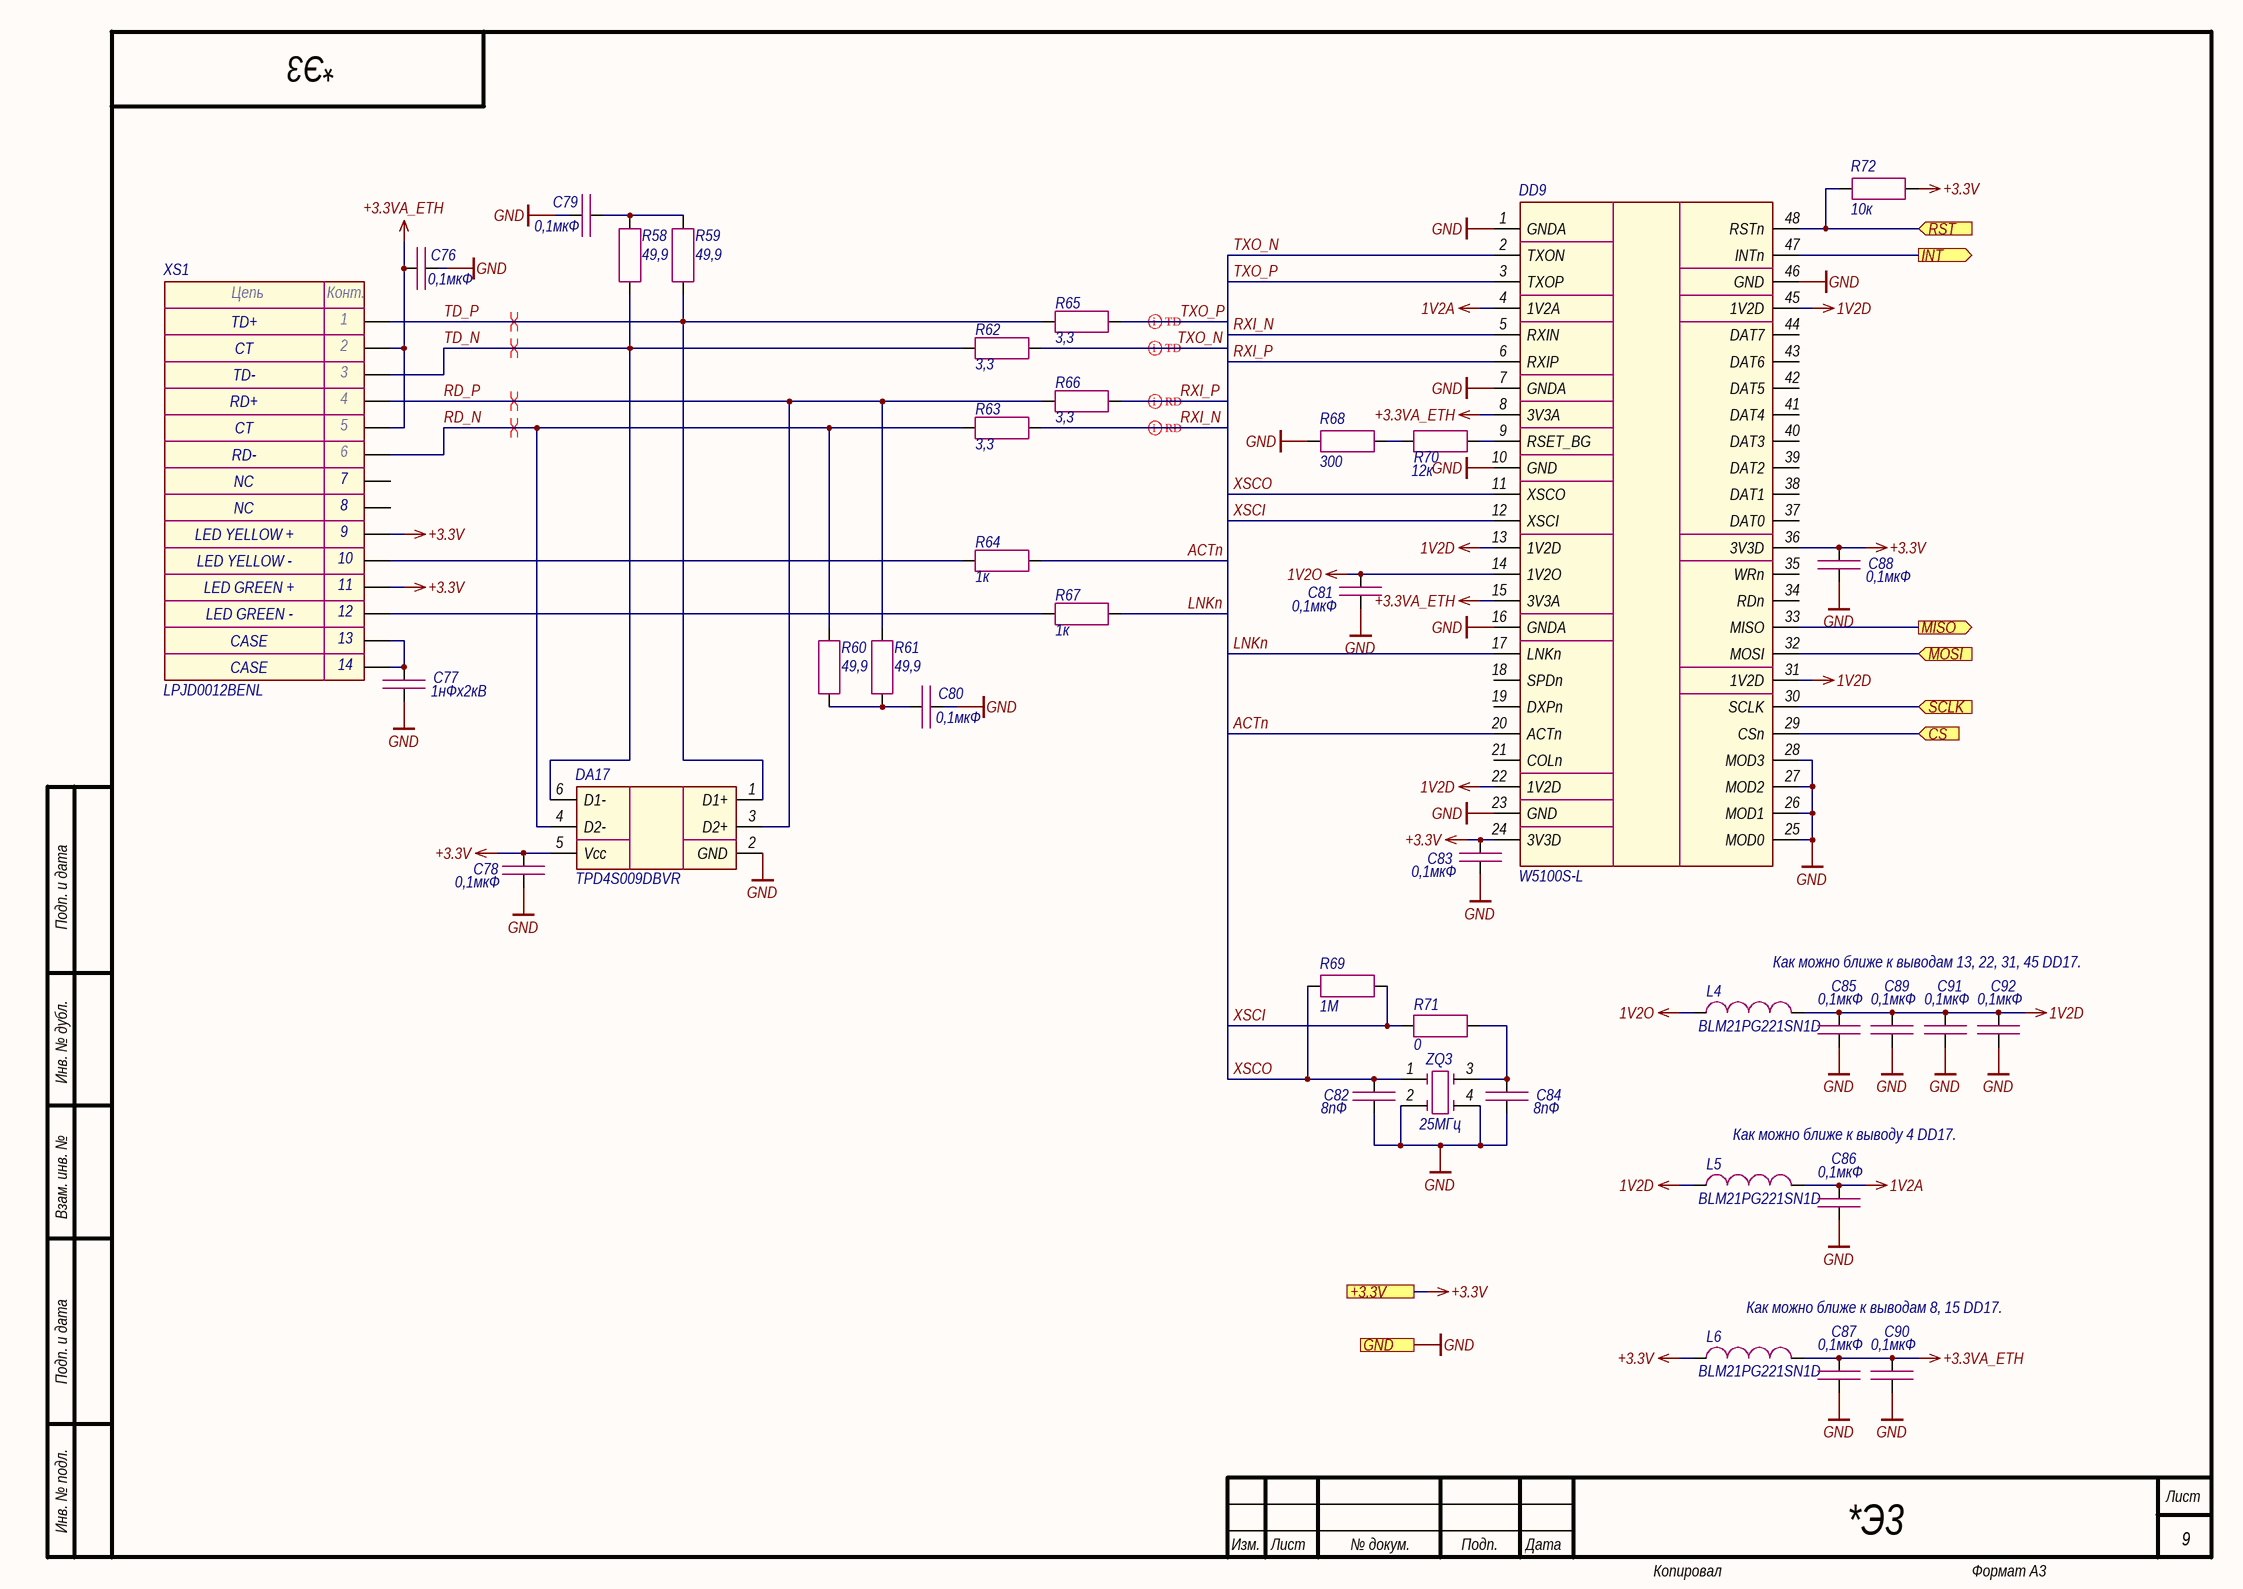
[diagram p3: Ethernet.SchDoc]

### Parts
C76  0,1мкФ  [CAP_0603]
C77  1нФх2кВ  [CAP_1206]
C78  0,1мкФ  [CAP_0603]
C79  0,1мкФ  [CAP_0603]
C80  0,1мкФ  [CAP_0603]
C81  0,1мкФ  [CAP_0603]
C82  8пФ  [CAP_0603]
C83  0,1мкФ  [CAP_0603]
C84  8пФ  [CAP_0603]
C85  0,1мкФ  [CAP_0603]
C86  0,1мкФ  [CAP_0603]
C87  0,1мкФ  [CAP_0603]
C88  0,1мкФ  [CAP_0603]
C89  0,1мкФ  [CAP_0603]
C90  0,1мкФ  [CAP_0603]
C91  0,1мкФ  [CAP_0603]
C92  0,1мкФ  [CAP_0603]
DA17  TPD4S009DBVR  [SOT-23-6]
DD9  W5100S-L  [LQFP-48]
L4  BLM21PG221SN1D  [IND_0805]
L5  BLM21PG221SN1D  [IND_0805]
L6  BLM21PG221SN1D  [IND_0805]
R58  49,9  [RES_0603]
R59  49,9  [RES_0603]
R60  49,9  [RES_0603]
R61  49,9  [RES_0603]
R62  3,3  [RES_0603]
R63  3,3  [RES_0603]
R64  1к  [RES_0603]
R65  3,3  [RES_0603]
R66  3,3  [RES_0603]
R67  1к  [RES_0603]
R68  300  [RES_0603]
R69  1М  [RES_0603]
R70  12к  [RES_0603]
R71  0  [RES_0603]
R72  10к  [RES_0603]
XS1  LPJD0012BENL  [LPJD0012BENL]
ZQ3  25МГц  [7M]

### Ports
+3.3V (see Main[3B], Fiber_interlock[2C], Flow_sensor[2C], Hardwiring[3D], LD_driver[1D], Power_supply[1D]), CS (in, see Main[2B]), GND (see Main[3B], Fiber_interlock[2C], Flow_sensor[2C], Guide_laser[1C], Hardwiring[3D], Indication[1C], LD_driver[1D], Power_supply[1D]), INT (out, see Main[3B]), MISO (out, see Main[2B]), MOSI (in, see Main[2B]), RST (in, see Main[3B]), SCLK (in, see Main[2B])

### Nets
1V2A: C86.1 DD9.4(1V2A) L5.2
1V2D: C85.1 C89.1 C91.1 C92.1 DD9.13(1V2D) DD9.22(1V2D) DD9.31(1V2D) DD9.45(1V2D) L4.2 L5.1
1V2O: C81.1 DD9.14(1V2O) L4.1
+3.3V: C78.1 C83.1 C88.1 DA17.5(Vcc) DD9.24(3V3D) DD9.36(3V3D) L6.1 R72.2 XS1.9 XS1.11 ; port +3.3V
+3.3VA_ETH: C76.1 C87.1 C90.1 DD9.8(3V3A) DD9.15(3V3A) L6.2 XS1.2 XS1.5
GND: C76.2 C77.2 C78.2 C79.2 C80.2 C81.2 C82.2 C83.2 C84.2 C85.2 C86.2 C87.2 C88.2 C89.2 C90.2 C91.2 C92.2 DA17.2(GND) DD9.1(GNDA) DD9.7(GNDA) DD9.10(GND) DD9.16(GNDA) DD9.23(GND) DD9.25(MOD0) DD9.26(MOD1) DD9.27(MOD2) DD9.28(MOD3) DD9.46(GND) R68.1 ZQ3.2 ZQ3.4 ; port GND
ACTn: DD9.20(ACTn) R64.2
ETH_CS: DD9.29(CSn) ; port CS
ETH_INT: DD9.47(INTn) ; port INT
ETH_MISO: DD9.33(MISO) ; port MISO
ETH_MOSI: DD9.32(MOSI) ; port MOSI
ETH_RST: DD9.48(RSTn) R72.1 ; port RST
ETH_SCLK: DD9.30(SCLK) ; port SCLK
LNKn: DD9.17(LNKn) R67.2
RD_N: DA17.4(D2-) R60.1 R63.2 XS1.6
RD_P: DA17.3(D2+) R61.1 R66.2 XS1.4
RXI_N: DD9.5(RXIN) R63.1
RXI_P: DD9.6(RXIP) R66.1
TD_N: DA17.6(D1-) R58.1 R62.2 XS1.3
TD_P: DA17.1(D1+) R59.1 R65.2 XS1.1
TXO_N: DD9.2(TXON) R62.1
TXO_P: DD9.3(TXOP) R65.1
XSCI: DD9.12(XSCI) R69.2 R71.1
XSCO: C82.1 DD9.11(XSCO) R69.1 ZQ3.1
NetC77_1: C77.1 XS1.13 XS1.14
NetC79_1: C79.1 R58.2 R59.2
NetC80_1: C80.1 R60.2 R61.2
NetC84_1: C84.1 R71.2 ZQ3.3
NetDD9_9: DD9.9(RSET_BG) R70.2
NetR64_1: R64.1 XS1.10
NetR67_1: R67.1 XS1.12
NetR68_2: R68.2 R70.1

Not connected (* = marked no-connect by the designer): DD9 18(SPDn) 19(DXPn) 21(COLn) 34(RDn) 35(WRn) 37(DAT0) 38(DAT1) 39(DAT2) 40(DAT3) 41(DAT4) 42(DAT5) 43(DAT6) 44(DAT7); XS1 7 8

### Layout directives
differential pair; differential pair class TD: TXO_N, TXO_P
differential pair; differential pair class RD: RXI_N, RXI_P
differential pair: RD_N, RD_P, TD_N, TD_P

### Notes on the sheet
- Как можно ближе к выводам 13, 22, 31, 45 DD17.
- Как можно ближе к выводу 4 DD17.
- Как можно ближе к выводам 8, 15 DD17.
- Подп. и дата
- Инв. № дубл.
- Взам. инв. №
- Инв. № подл.
- Изм.
- Лист
- № докум.
- Подп.
- Дата
- Копировал
- Формат А3
- (in symbol LPJD0012BENL) Цепь; Конт.; TD+; CT; TD-; RD+; RD-; NC; LED YELLOW +; LED YELLOW -; LED GREEN +; LED GREEN -; CASE

### Library data of the parts
C76 C78-C81 C83 C85-C92 = Capacitor: as C4 on sheet Main; Value: 0,1мкФ; Document: *
C77 = Capacitor: Manufacturer: Yageo; Model: CC1206KKX7RDBB102; Value: 1нФх2кВ; Document: *
C82 C84 = Capacitor: as C21 on sheet Main; Value: 8пФ; Document: *
DA17 = TPD4S009: Manufacturer: Texas Instruments; Model: TPD4S009DBVR; Document: *
DD9 = W5100S: Manufacturer: Wiznet; Model: W5100S-L; Document: *
L4-L6 = Inductor: Manufacturer: Murata; Value: *; Model: BLM21PG221SN1D; Document: *
R58-R61 = Resistor: Manufacturer: Yageo; Model: RC0603FR-0749R9L; Value: 49,9; Document: *
R62 R63 R65 R66 = Resistor: Manufacturer: Yageo; Model: RC0603FR-073R3L; Value: 3,3; Document: *
R64 R67 = Resistor: Manufacturer: Yageo; Model: RC0603FR-071KL; Value: 1к; Document: *
R68 = Resistor: Manufacturer: Yageo; Model: RC0603FR-07300RL; Value: 300; Document: *
R69 = Resistor: Manufacturer: Yageo; Model: RC0603FR-071ML; Value: 1М; Document: *
R70 = Resistor: Manufacturer: Yageo; Model: RC0603FR-0712KL; Value: 12к; Document: *
R71 = Resistor: as R2 on sheet Main; Value: 0; Document: *
R72 = Resistor: as R9 on sheet Main; Value: 10к; Document: *
XS1 = LPJD0012BENL: Manufacturer: LINK-PP; Model: LPJD0012BENL; Document: *
ZQ3 = Quartz_Resonator_4-pin: Manufacturer: TXC; Model: 7M-25.000MAAJ-T; Value: 25МГц; Document: *

## Sheet Photodiode.SchDoc
size 420 x 297 mm; Address1: Address1; Address2: Address2; Address3: Address3; Address4: Address4; DocumentNumber: *Э3; SheetNumber: 2; SheetTotal: 11; DocumentType: Схема электрическая *
Used 3 times, as channels A1, A2, A11. Parts and nets are listed once, with the designators drawn on the sheet.
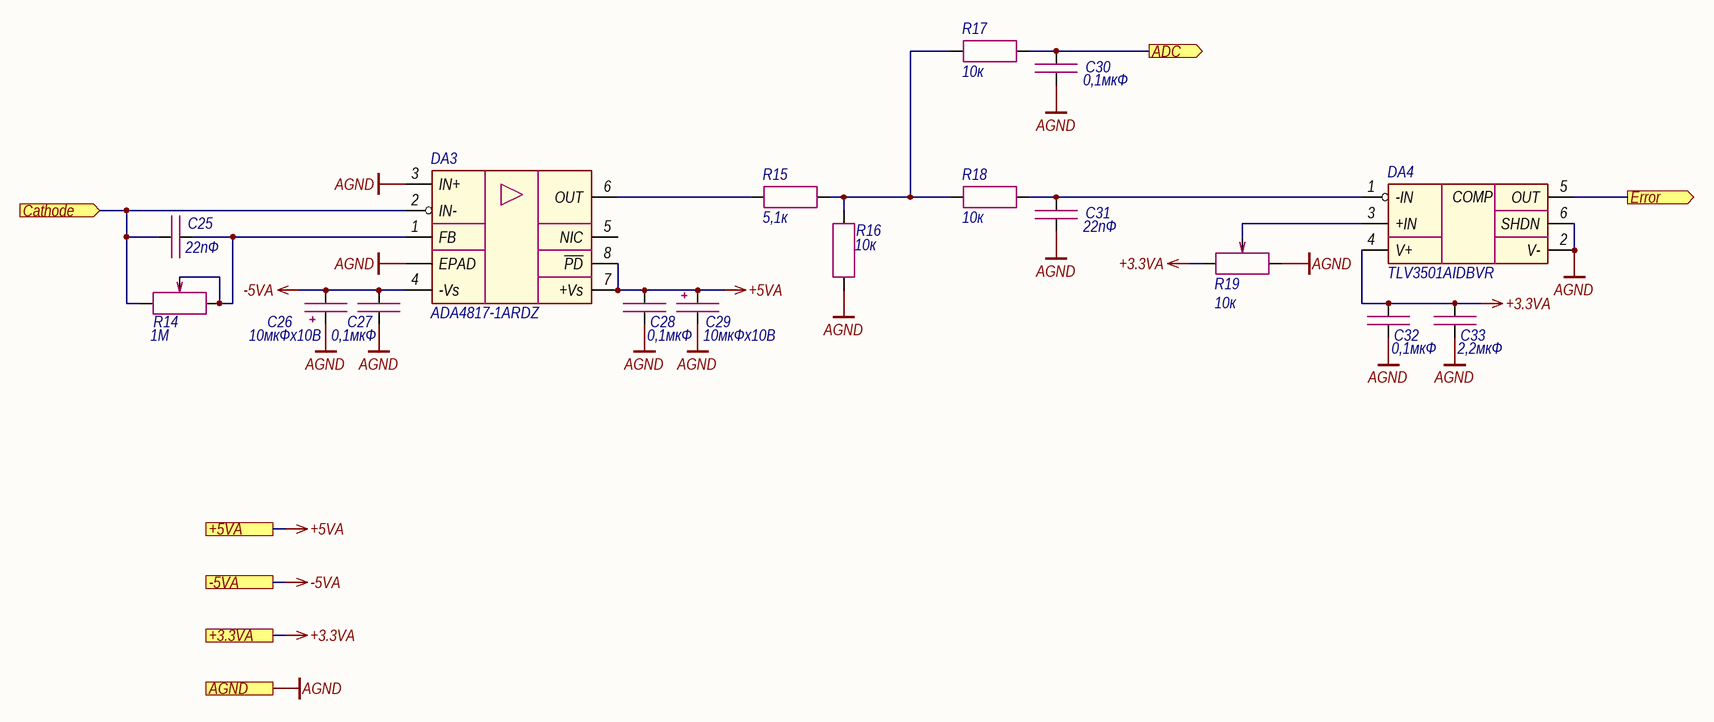
[diagram p4: Photodiode.SchDoc]

### Parts
C25  22пФ  [CAP_0603]
C26  10мкФх10B  [CAP_A]
C27  0,1мкФ  [CAP_0603]
C28  0,1мкФ  [CAP_0603]
C29  10мкФх10B  [CAP_A]
C30  0,1мкФ  [CAP_0603]
C31  22пФ  [CAP_0603]
C32  0,1мкФ  [CAP_0603]
C33  2,2мкФ  [CAP_0603]
DA3  ADA4817-1ARDZ  [SOIC-8 EPAD]
DA4  TLV3501AIDBVR  [SOT-23-6]
R14  1М  [3224W]
R15  5,1к  [RES_0603]
R16  10к  [RES_0603]
R17  10к  [RES_0603]
R18  10к  [RES_0603]
R19  10к  [3224W]

### Ports
+3.3VA (see Main[2A], Hardwiring[4D], LD_driver[1D], Thermistor[2C]), +5VA (see Main[1A], LD_driver[1D]), -5VA (see Main[1A]), ADC (out, see Main[2A]), AGND (see Main[1A], Hardwiring[4D], LD_driver[1D], Thermistor[2C]), Cathode (in, see Main[1A]), Error (out, see Main[2A])

### Nets
+3.3VA: C32.1 C33.1 DA4.4(V+) R19.3 ; port +3.3VA
+5VA: C28.1 C29.1 DA3.7(+Vs) DA3.8(~{PD}) ; port +5VA
-5VA: C26.2 C27.1 DA3.4(-Vs) ; port -5VA
AGND: C26.1 C27.2 C28.2 C29.2 C30.2 C31.2 C32.2 C33.2 DA3.3(IN+) DA3.EPAD DA4.2(V-) DA4.6(SHDN) R16.2 R19.1 ; port AGND
ADC: C30.1 R17.2 ; port ADC
Cathode: C25.2 DA3.2(IN-) R14.1 ; port Cathode
Error: DA4.5(OUT) ; port Error
NetC25_1: C25.1 DA3.1(FB) R14.2 R14.3
NetC31_1: C31.1 DA4.1(-IN) R18.2
NetDA3_6: DA3.6(OUT) R15.1
NetDA4_3: DA4.3(+IN) R19.2
NetR15_2: R15.2 R16.1 R17.1 R18.1

Not connected (* = marked no-connect by the designer): DA3 5(NIC)

### Channels
A1: designators end in A1; ports +3.3VA=+3.3VA +5VA=+5VA -5VA=-5VA ADC=PD3_ADC AGND=AGND Cathode=PD3 Error=PD3_ERR
A2: designators end in A2; ports +3.3VA=+3.3VA +5VA=+5VA -5VA=-5VA ADC=PD2_ADC AGND=AGND Cathode=PD2 Error=PD2_ERR
A11: designators end in A11; ports +3.3VA=+3.3VA +5VA=+5VA -5VA=-5VA ADC=PD1_ADC AGND=AGND Cathode=PD1 Error=PD1_ERR

### Notes on the sheet
- Подп. и дата
- Инв. № дубл.
- Взам. инв. №
- Инв. № подл.
- Изм.
- Лист
- № докум.
- Подп.
- Дата
- Копировал
- Формат А3
- (in symbol TLV3501) COMP

### Library data of the parts
C25 C31 = Capacitor: Manufacturer: Murata; Model: GRM1885C1H220JA01D; Value: 22пФ; Document: *
C26 C29 = Capacitor_Polar: Model: TECAP, 10 мкФ, 10 В, тип A, 10%; Value: 10мкФх10B; Document: *; Manufacturer: *
C27 C28 C30 C32 = Capacitor: as C4 on sheet Main; Value: 0,1мкФ; Document: *
C33 = Capacitor: as C7 on sheet Main; Value: 2,2мкФ; Document: *
DA3 = ADA4817-1ARDZ: Manufacturer: Analog Devices; Model: ADA4817-1ARDZ; Document: *
DA4 = TLV3501: Manufacturer: Texas Instruments; Model: TLV3501AIDBVR; Document: *
R14 = Resistor_Variable: Manufacturer: Bourns; Model: 3224W-1-105; Value: 1М; Document: *
R15 = Resistor: Manufacturer: Yageo; Model: RC0603FR-075K1L; Value: 5,1к; Document: *
R16-R18 = Resistor: as R9 on sheet Main; Value: 10к; Document: *
R19 = Resistor_Variable: Manufacturer: Bourns; Model: 3224W-1-103; Value: 10к; Document: *

## Sheet Thermistor.SchDoc
size 209 x 297 mm; Address1: Address1; Address2: Address2; Address3: Address3; Address4: Address4; DocumentNumber: *Э3; SheetNumber: 3; SheetTotal: 11; DocumentType: Схема электрическая *
Used 2 times, as channels A3, A4. Parts and nets are listed once, with the designators drawn on the sheet.
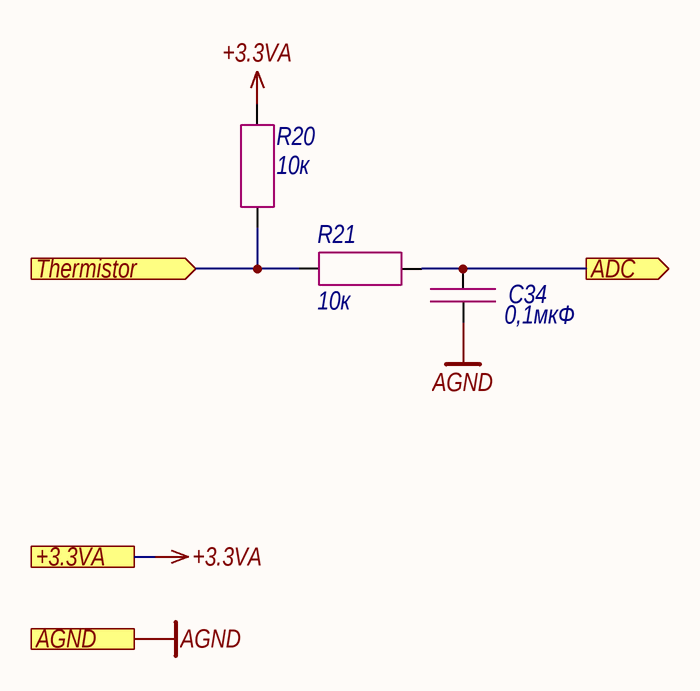
[diagram p5: Thermistor.SchDoc]

### Parts
C34  0,1мкФ  [CAP_0603]
R20  10к  [RES_0603]
R21  10к  [RES_0603]

### Ports
+3.3VA (see Main[1B], Hardwiring[4D], LD_driver[1D], Photodiode[1C]), ADC (out, see Main[2B]), AGND (see Main[1B], Hardwiring[4D], LD_driver[1D], Photodiode[1C]), Thermistor (in, see Main[1A])

### Nets
+3.3VA: R20.1 ; port +3.3VA
AGND: C34.2 ; port AGND
ADC: C34.1 R21.2 ; port ADC
Thermistor: R20.2 R21.1 ; port Thermistor

### Channels
A3: designators end in A3; ports +3.3VA=+3.3VA ADC=T1_ADC AGND=AGND Thermistor=T1
A4: designators end in A4; ports +3.3VA=+3.3VA ADC=T2_ADC AGND=AGND Thermistor=T2

### Notes on the sheet
- Подп. и дата
- Инв. № дубл.
- Взам. инв. №
- Инв. № подл.
- Изм.
- Лист
- № докум.
- Подп.
- Дата
- Копировал
- Формат А4

### Library data of the parts
C34 = Capacitor: as C4 on sheet Main; Value: 0,1мкФ; Document: *
R20 R21 = Resistor: as R9 on sheet Main; Value: 10к; Document: *

## Sheet Power_supply.SchDoc
size 420 x 297 mm; Address1: Address1; Address2: Address2; Address3: Address3; Address4: Address4; DocumentNumber: *Э3; SheetNumber: 4; SheetTotal: 11; DocumentType: Схема электрическая *
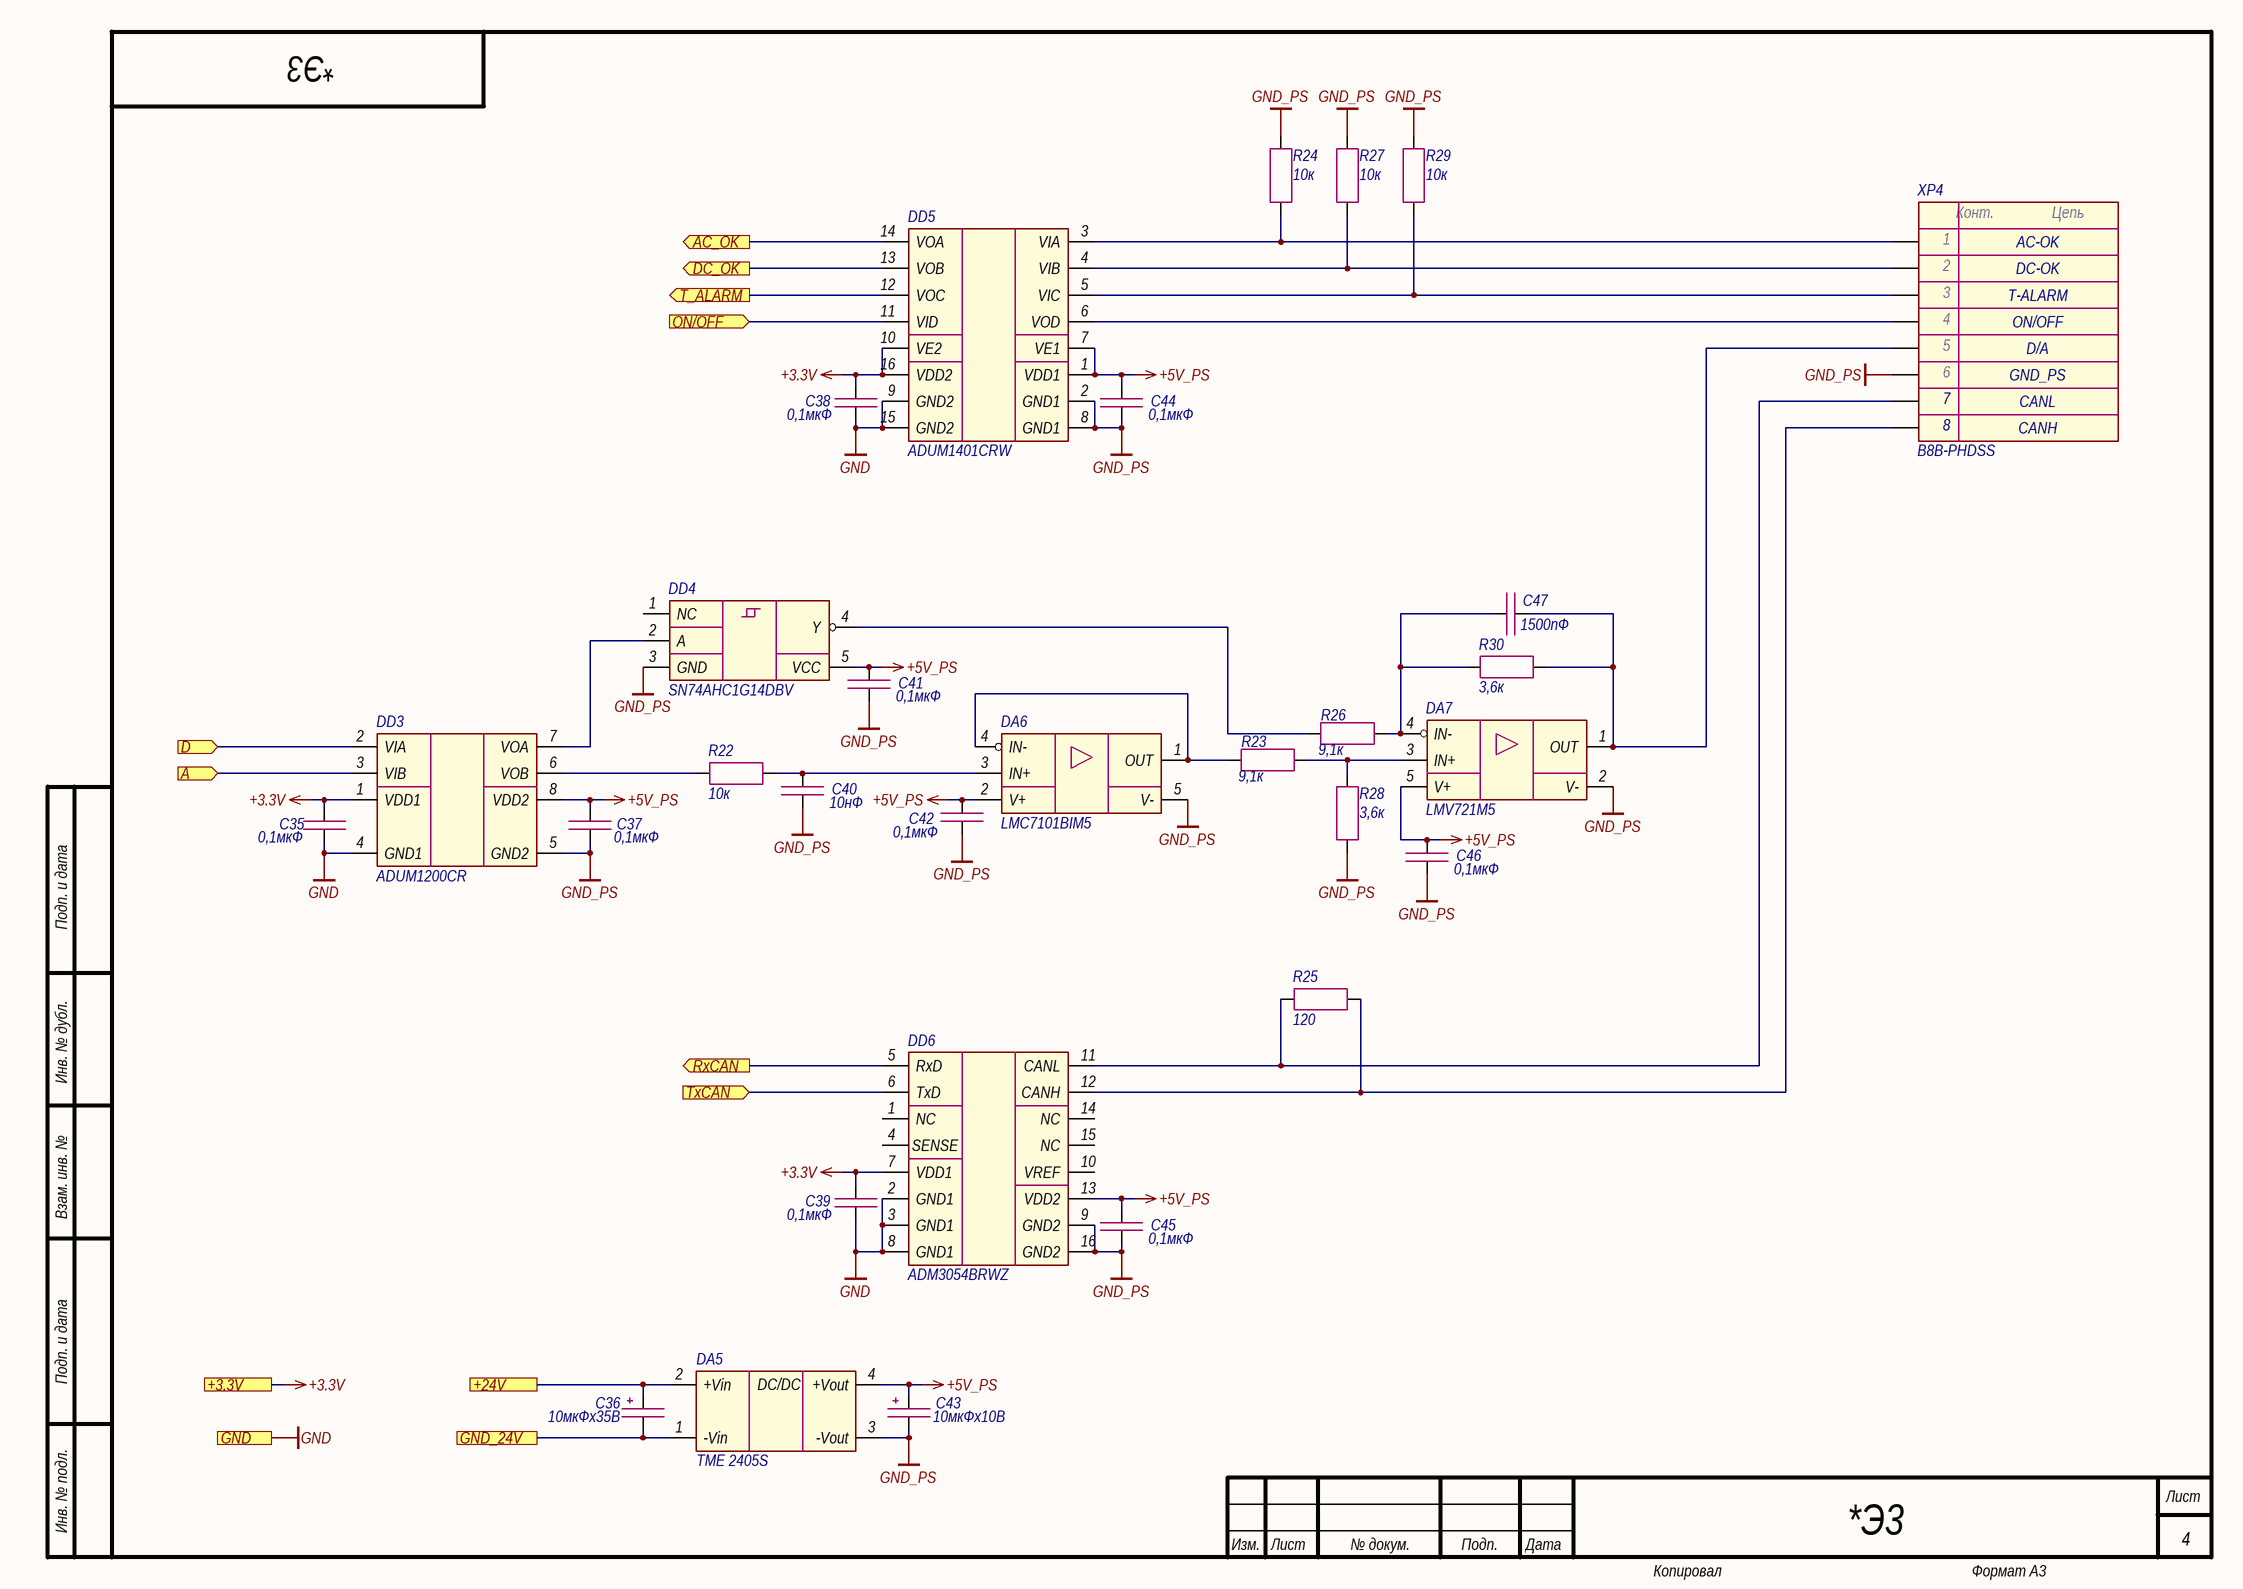
[diagram p6: Power_supply.SchDoc]

### Parts
C35  0,1мкФ  [CAP_0603]
C36  10мкФх35B  [CAP_C]
C37  0,1мкФ  [CAP_0603]
C38  0,1мкФ  [CAP_0603]
C39  0,1мкФ  [CAP_0603]
C40  10нФ  [CAP_0603]
C41  0,1мкФ  [CAP_0603]
C42  0,1мкФ  [CAP_0603]
C43  10мкФх10B  [CAP_A]
C44  0,1мкФ  [CAP_0603]
C45  0,1мкФ  [CAP_0603]
C46  0,1мкФ  [CAP_0603]
C47  1500пФ  [CAP_0603]
DA5  TME 2405S  [TME (SIP-4)]
DA6  LMC7101BIM5  [SOT-23-5]
DA7  LMV721M5  [SOT-23-5]
DD3  ADUM1200CR  [SOIC-8]
DD4  SN74AHC1G14DBV  [SOT-23-5]
DD5  ADUM1401CRW  [SOIC-16W]
DD6  ADM3054BRWZ  [SOIC-16W]
R22  10к  [RES_0603]
R23  9,1к  [RES_0603]
R24  10к  [RES_0603]
R25  120  [RES_0603]
R26  9,1к  [RES_0603]
R27  10к  [RES_0603]
R28  3,6к  [RES_0603]
R29  10к  [RES_0603]
R30  3,6к  [RES_0603]
XP4  B8B-PHDSS  [B8B-PHDSS]

### Ports
+3.3V (see Main[1B], Ethernet[3D], Fiber_interlock[2C], Flow_sensor[2C], Hardwiring[3D], LD_driver[1D]), +24V (see Main[1B], Flow_sensor[2C], Hardwiring[3C], Indication[1C], LD_driver[1D]), A (in, see Main[1B]), AC_OK (out, see Main[2B]), D (in, see Main[1B]), DC_OK (out, see Main[2B]), GND (see Main[1B], Ethernet[3D], Fiber_interlock[2C], Flow_sensor[2C], Guide_laser[1C], Hardwiring[3D], Indication[1C], LD_driver[1D]), GND_24V (see Main[1B], Flow_sensor[2C], Hardwiring[3C], Indication[1C], LD_driver[1D]), ON/OFF (in, see Main[1B]), RxCAN (out, see Main[2B]), T_ALARM (out, see Main[2B]), TxCAN (in, see Main[2B])

### Nets
+3.3V: C35.1 C38.1 C39.1 DD3.1(VDD1) DD5.10(VE2) DD5.16(VDD2) DD6.7(VDD1) ; port +3.3V
+5V_PS: C37.1 C41.1 C42.1 C43.1 C44.1 C45.1 C46.1 DA5.4(+Vout) DA6.2(V+) DA7.5(V+) DD3.8(VDD2) DD4.5(VCC) DD5.1(VDD1) DD5.7(VE1) DD6.13(VDD2)
+24V: C36.1 DA5.2(+Vin) ; port +24V
GND: C35.2 C38.2 C39.2 DD3.4(GND1) DD5.9(GND2) DD5.15(GND2) DD6.2(GND1) DD6.3(GND1) DD6.8(GND1) ; port GND
GND_24V: C36.2 DA5.1(-Vin) ; port GND_24V
GND_PS: C37.2 C40.2 C41.2 C42.2 C43.2 C44.2 C45.2 C46.2 DA5.3(-Vout) DA6.5(V-) DA7.2(V-) DD3.5(GND2) DD4.3(GND) DD5.2(GND1) DD5.8(GND1) DD6.9(GND2) DD6.16(GND2) R24.1 R27.1 R28.2 R29.1 XP4.6
PS_A: DD3.3(VIB) ; port A
PS_D: DD3.2(VIA) ; port D
PS_ERR1: DD5.14(VOA) ; port AC_OK
PS_ERR2: DD5.13(VOB) ; port DC_OK
PS_ERR3: DD5.12(VOC) ; port T_ALARM
PS_ON: DD5.11(VID) ; port ON/OFF
RxCAN: DD6.5(RxD) ; port RxCAN
TxCAN: DD6.6(TxD) ; port TxCAN
NetC40_1: C40.1 DA6.3(IN+) R22.2
NetC47_1: C47.1 DA7.4(IN-) R26.1 R30.2
NetC47_2: C47.2 DA7.1(OUT) R30.1 XP4.5
NetDA6_1: DA6.1(OUT) DA6.4(IN-) R23.2
NetDA7_3: DA7.3(IN+) R23.1 R28.1
NetDD3_6: DD3.6(VOB) R22.1
NetDD3_7: DD3.7(VOA) DD4.2(A)
NetDD4_4: DD4.4(Y) R26.2
NetDD5_3: DD5.3(VIA) R24.2 XP4.1
NetDD5_4: DD5.4(VIB) R27.2 XP4.2
NetDD5_5: DD5.5(VIC) R29.2 XP4.3
NetDD5_6: DD5.6(VOD) XP4.4
NetDD6_11: DD6.11(CANL) R25.1 XP4.7
NetDD6_12: DD6.12(CANH) R25.2 XP4.8

Not connected (* = marked no-connect by the designer): DD4 1(NC); DD6 1(NC) 4(SENSE) 10(VREF) 14(NC) 15(NC)

### Notes on the sheet
- AC-OK
- DC-OK
- T-ALARM
- ON/OFF
- CANL
- GND_PS
- D/A
- CANH
- Подп. и дата
- Инв. № дубл.
- Взам. инв. №
- Инв. № подл.
- Изм.
- Лист
- № докум.
- Подп.
- Дата
- Копировал
- Формат А3
- (in symbol Connector-8) Конт.; Цепь
- (in symbol TME) DC/DC

### Library data of the parts
C35 C37-C39 C41 C42 C44-C46 = Capacitor: as C4 on sheet Main; Value: 0,1мкФ; Document: *
C36 = Capacitor_Polar: Model: TECAP, 10 мкФ, 35 В, тип C, 10%; Value: 10мкФх35B; Document: *; Manufacturer: *
C40 = Capacitor: Manufacturer: Murata; Model: GRM188R71H103JA01D; Value: 10нФ; Document: *
C43 = Capacitor_Polar: Model: TECAP, 10 мкФ, 10 В, тип A, 10%; Value: 10мкФх10B; Document: *; Manufacturer: *
C47 = Capacitor: Manufacturer: Murata; Model: GRM188R71H152KA01D; Value: 1500пФ; Document: *
DA5 = TME: Manufacturer: Traco Power; Model: TME 2405S; Document: *
DA6 = LMC7101: Manufacturer: Texas Instruments; Model: LMC7101BIM5; Document: *
DA7 = LMV721M5: Manufacturer: Texas Instruments; Model: LMV721M5; Document: *
DD3 = ADUM1200: Manufacturer: Analog Devices; Model: ADUM1200CR; Document: *
DD4 = SN74AHC1G14: Manufacturer: Texas Instruments; Model: SN74AHC1G14DBV; Document: *
DD5 = ADUM1401: Manufacturer: Analog Devices; Model: ADUM1401CRW; Document: *
DD6 = ADM3054BRWZ: Manufacturer: Analog Devices; Model: ADM3054BRWZ; Document: *
R22 R24 R27 R29 = Resistor: as R9 on sheet Main; Value: 10к; Document: *
R23 R26 = Resistor: Manufacturer: Yageo; Model: RC0603FR-079K1L; Value: 9,1к; Document: *
R25 = Resistor: Manufacturer: Yageo; Model: RC0603FR-07120RL; Value: 120; Document: *
R28 R30 = Resistor: Manufacturer: Yageo; Model: RC0603FR-073K6L; Value: 3,6к; Document: *
XP4 = Connector-8: Manufacturer: JST; Model: B8B-PHDSS; Document: *

## Sheet LD_driver.SchDoc
size 420 x 297 mm; Address1: Address1; Address2: Address2; Address3: Address3; Address4: Address4; DocumentNumber: *Э3; SheetNumber: 5; SheetTotal: 11; DocumentType: Схема электрическая *
Used 2 times, as channels A6, A7. Parts and nets are listed once, with the designators drawn on the sheet.
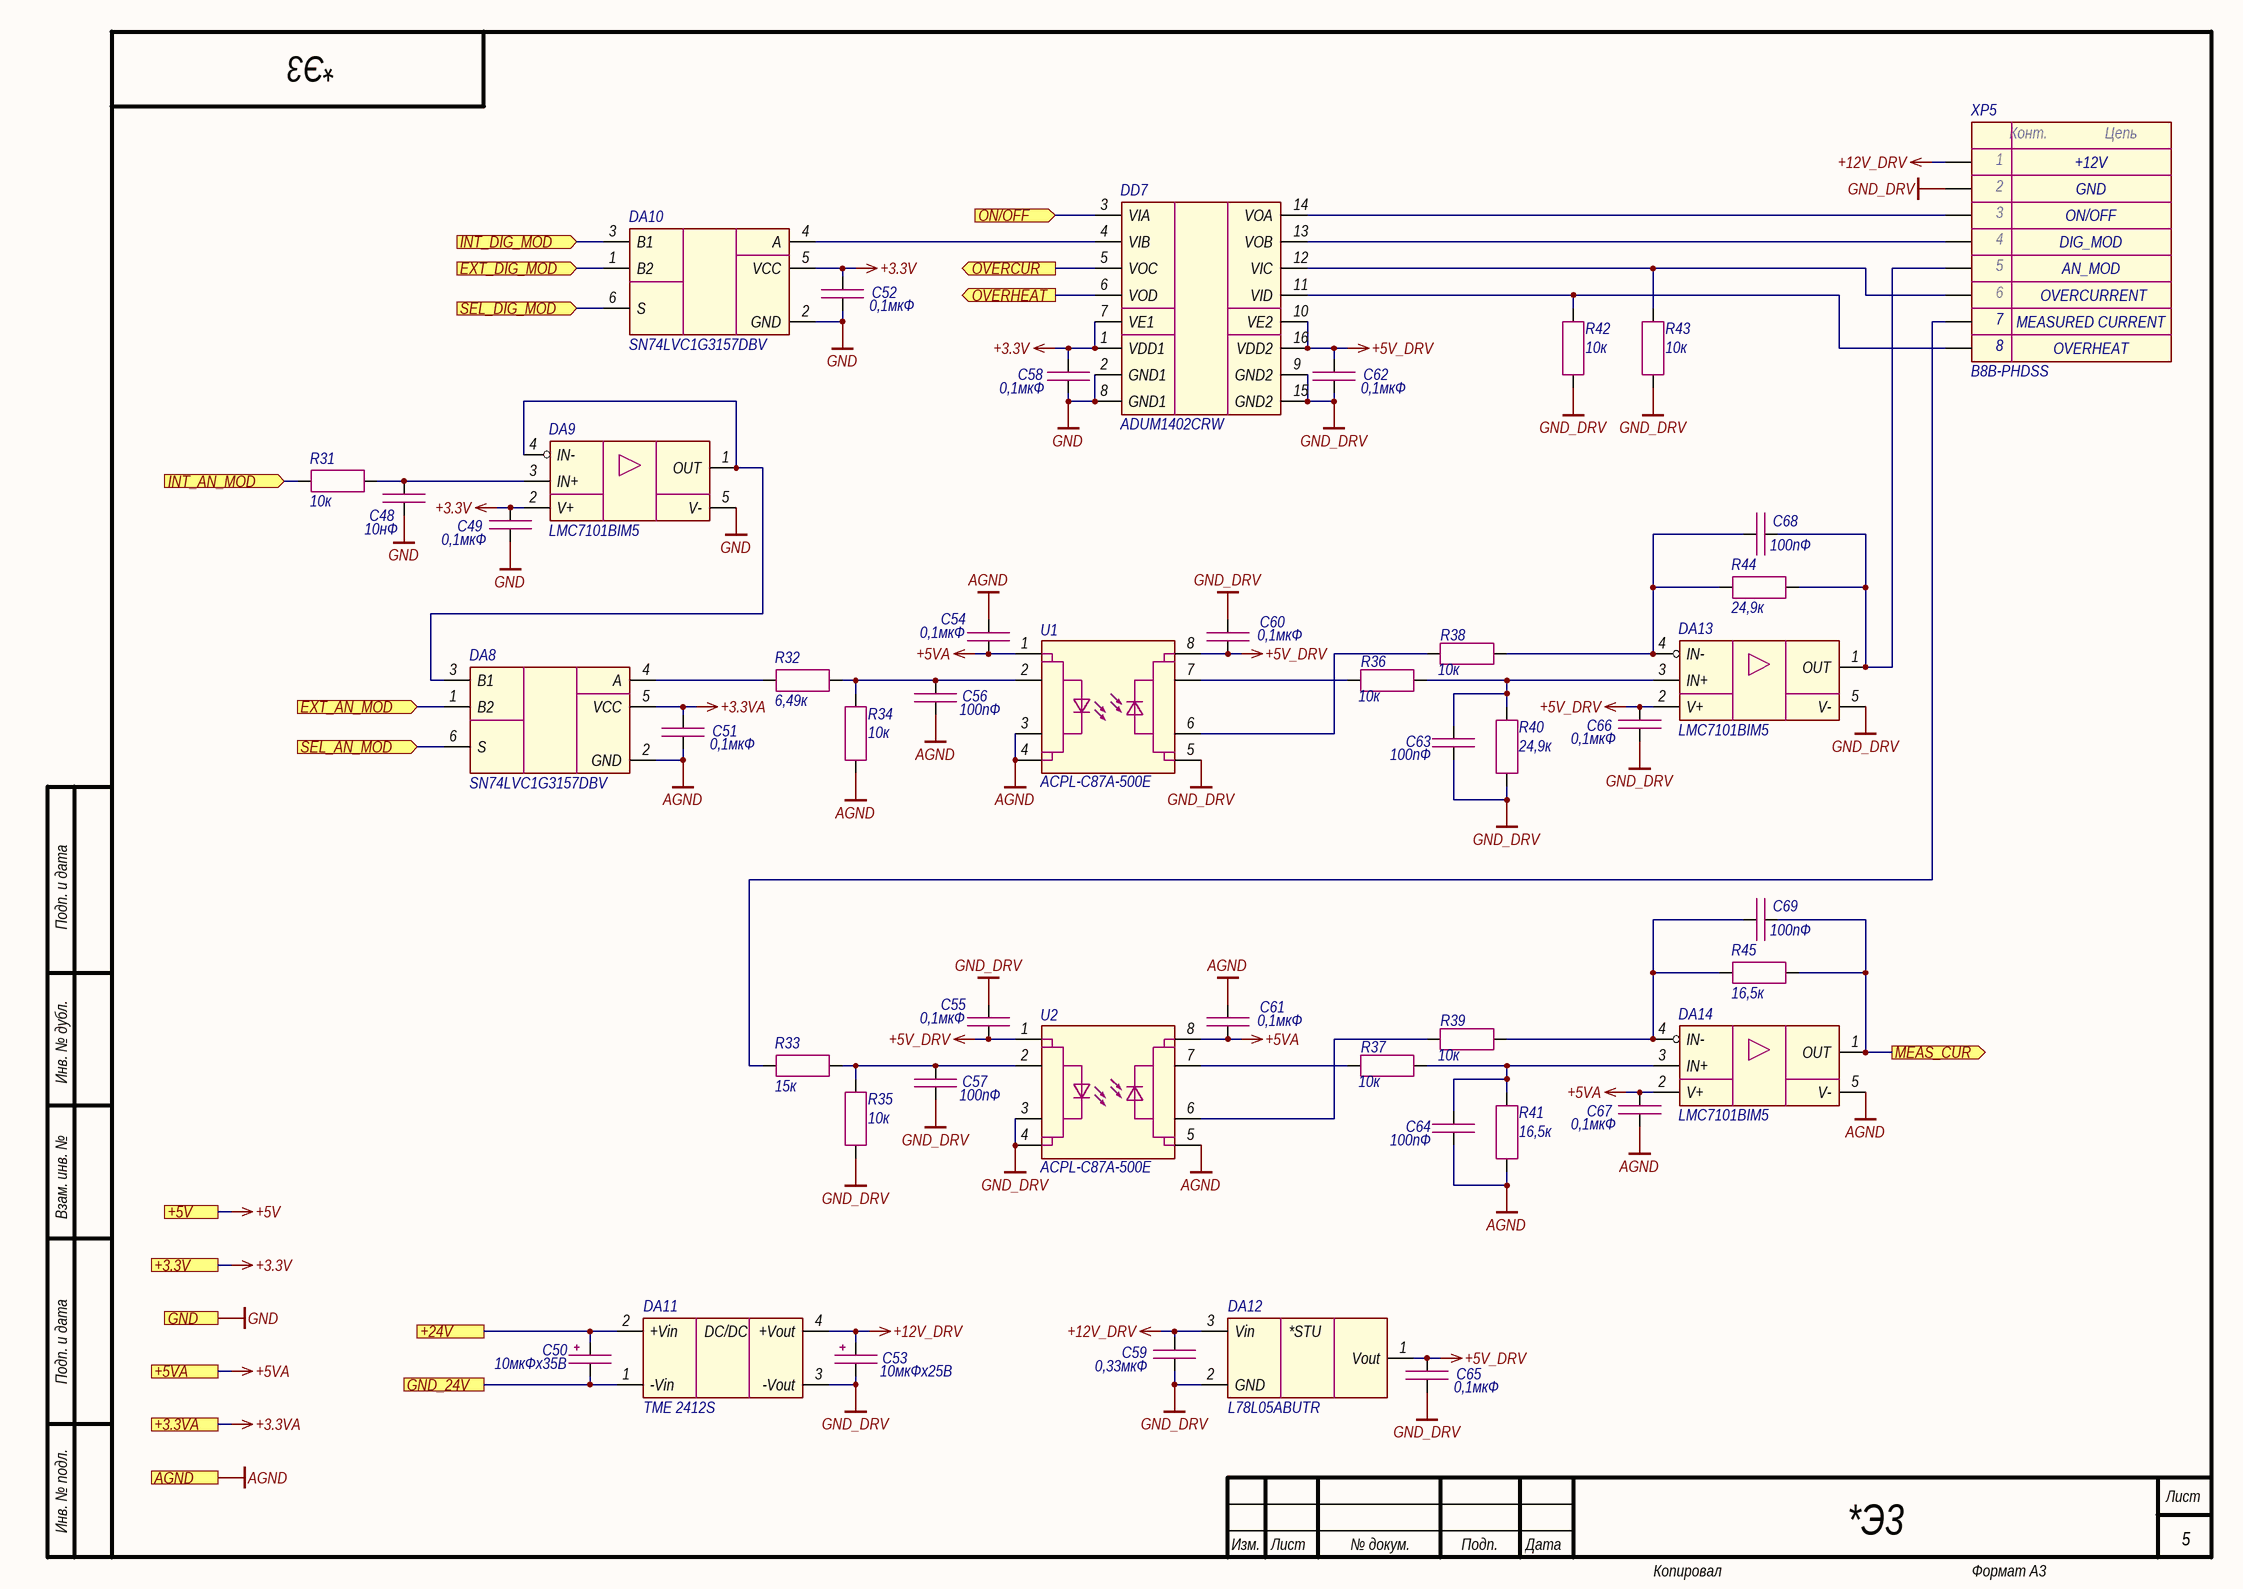
[diagram p7: LD_driver.SchDoc]

### Parts
C48  10нФ  [CAP_0603]
C49  0,1мкФ  [CAP_0603]
C50  10мкФх35B  [CAP_C]
C51  0,1мкФ  [CAP_0603]
C52  0,1мкФ  [CAP_0603]
C53  10мкФх25B  [CAP_C]
C54  0,1мкФ  [CAP_0603]
C55  0,1мкФ  [CAP_0603]
C56  100пФ  [CAP_0603]
C57  100пФ  [CAP_0603]
C58  0,1мкФ  [CAP_0603]
C59  0,33мкФ  [CAP_0805]
C60  0,1мкФ  [CAP_0603]
C61  0,1мкФ  [CAP_0603]
C62  0,1мкФ  [CAP_0603]
C63  100пФ  [CAP_0603]
C64  100пФ  [CAP_0603]
C65  0,1мкФ  [CAP_0603]
C66  0,1мкФ  [CAP_0603]
C67  0,1мкФ  [CAP_0603]
C68  100пФ  [CAP_0603]
C69  100пФ  [CAP_0603]
DA8  SN74LVC1G3157DBV  [SOT-23-6]
DA9  LMC7101BIM5  [SOT-23-5]
DA10  SN74LVC1G3157DBV  [SOT-23-6]
DA11  TME 2412S  [TME (SIP-4)]
DA12  L78L05ABUTR  [SOT-89]
DA13  LMC7101BIM5  [SOT-23-5]
DA14  LMC7101BIM5  [SOT-23-5]
DD7  ADUM1402CRW  [SOIC-16W]
R31  10к  [RES_0603]
R32  6,49к  [RES_0603]
R33  15к  [RES_0603]
R34  10к  [RES_0603]
R35  10к  [RES_0603]
R36  10к  [RES_0603]
R37  10к  [RES_0603]
R38  10к  [RES_0603]
R39  10к  [RES_0603]
R40  24,9к  [RES_0603]
R41  16,5к  [RES_0603]
R42  10к  [RES_0603]
R43  10к  [RES_0603]
R44  24,9к  [RES_0603]
R45  16,5к  [RES_0603]
U1  ACPL-C87A-500E  [SSO-8]
U2  ACPL-C87A-500E  [SSO-8]
XP5  B8B-PHDSS  [B8B-PHDSS]

### Ports
+3.3V (see Main[2C], Ethernet[3D], Fiber_interlock[2C], Flow_sensor[2C], Hardwiring[3D], Power_supply[1D]), +3.3VA (see Main[2C], Hardwiring[4D], Photodiode[1C], Thermistor[2C]), +5V (see Main[2C], Guide_laser[1C]), +5VA (see Main[2C], Photodiode[1C]), +24V (see Main[1C], Flow_sensor[2C], Hardwiring[3C], Indication[1C], Power_supply[1D]), AGND (see Main[2C], Hardwiring[4D], Photodiode[1C], Thermistor[2C]), EXT_AN_MOD (in, see Main[1C]), EXT_DIG_MOD (in, see Main[1B]), GND (see Main[2C], Ethernet[3D], Fiber_interlock[2C], Flow_sensor[2C], Guide_laser[1C], Hardwiring[3D], Indication[1C], Power_supply[1D]), GND_24V (see Main[1C], Flow_sensor[2C], Hardwiring[3C], Indication[1C], Power_supply[1D]), INT_AN_MOD (in, see Main[1C]), INT_DIG_MOD (in, see Main[1B]), MEAS_CUR (out, see Main[2B]), ON/OFF (in, see Main[1B]), OVERCUR (out, see Main[2B]), OVERHEAT (out, see Main[2B]), SEL_AN_MOD (in, see Main[1C]), SEL_DIG_MOD (in, see Main[1C])

### Nets
+3.3V: C49.1 C52.1 C58.1 DA9.2(V+) DA10.5(VCC) DD7.1(VDD1) DD7.7(VE1) ; port +3.3V
+3.3VA: C51.1 DA8.5(VCC) ; port +3.3VA
+5V_DRV: C55.1 C60.1 C62.1 C65.1 C66.1 DA12.1(Vout) DA13.2(V+) DD7.10(VE2) DD7.16(VDD2) U1.8(VDD2) U2.1(VDD1)
+5VA: C54.1 C61.1 C67.1 DA14.2(V+) U1.1(VDD1) U2.8(VDD2) ; port +5VA
+12V_DRV: C53.1 C59.2 DA11.4(+Vout) DA12.3(Vin) XP5.1
AGND: C51.2 C54.2 C56.1 C61.2 C64.2 C67.2 DA8.2(GND) DA14.5(V-) R34.2 R41.2 U1.3(SHDN) U1.4(GND1) U2.5(GND2) ; port AGND
GND: C48.2 C49.2 C52.2 C58.2 DA9.5(V-) DA10.2(GND) DD7.2(GND1) DD7.8(GND1) ; port GND
GND_DRV: C53.2 C55.2 C57.1 C59.1 C60.2 C62.2 C63.2 C65.2 C66.2 DA11.3(-Vout) DA12.2(GND) DA13.5(V-) DD7.9(GND2) DD7.15(GND2) R35.2 R40.1 R42.2 R43.2 U1.5(GND2) U2.3(SHDN) U2.4(GND1) XP5.2
+24V: C50.1 DA11.2(+Vin) ; port +24V
EXT_AN_MOD: DA8.1(B2) ; port EXT_AN_MOD
EXT_DIG_MOD: DA10.1(B2) ; port EXT_DIG_MOD
GND_24V: C50.2 DA11.1(-Vin) ; port GND_24V
INT_AN_MOD: R31.1 ; port INT_AN_MOD
INT_DIG_MOD: DA10.3(B1) ; port INT_DIG_MOD
MEAS_CUR: C69.2 DA14.1(OUT) R45.1 ; port MEAS_CUR
ON/OFF: DD7.3(VIA) ; port ON/OFF
OVERCUR: DD7.5(VOC) ; port OVERCUR
OVERHEAT: DD7.6(VOD) ; port OVERHEAT
SEL_AN_MOD: DA8.6(S) ; port SEL_AN_MOD
SEL_DIG_MOD: DA10.6(S) ; port SEL_DIG_MOD
NetC48_1: C48.1 DA9.3(IN+) R31.2
NetC56_2: C56.2 R32.1 R34.1 U1.2(VIN)
NetC57_2: C57.2 R33.1 R35.1 U2.2(VIN)
NetC63_1: C63.1 DA13.3(IN+) R36.2 R40.2
NetC64_1: C64.1 DA14.3(IN+) R37.2 R41.1
NetC68_1: C68.1 DA13.4(IN-) R38.2 R44.1
NetC68_2: C68.2 DA13.1(OUT) R44.2 XP5.5
NetC69_1: C69.1 DA14.4(IN-) R39.2 R45.2
NetDA8_3: DA8.3(B1) DA9.1(OUT) DA9.4(IN-)
NetDA8_4: DA8.4(A) R32.2
NetDA10_4: DA10.4(A) DD7.4(VIB)
NetDD7_11: DD7.11(VID) R42.1 XP5.8
NetDD7_12: DD7.12(VIC) R43.1 XP5.6
NetDD7_13: DD7.13(VOB) XP5.4
NetDD7_14: DD7.14(VOA) XP5.3
NetR33_2: R33.2 XP5.7
NetR36_1: R36.1 U1.7(VOUT+)
NetR37_1: R37.1 U2.7(VOUT+)
NetR38_1: R38.1 U1.6(VOUT-)
NetR39_1: R39.1 U2.6(VOUT-)

### Channels
A6: designators end in A6; ports +3.3V=+3.3V +3.3VA=+3.3VA +5V=+5V +5VA=+5VA +24V=+24V AGND=AGND EXT_AN_MOD=EXT_AN_MOD EXT_DIG_MOD=EXT_DIG_MOD GND=GND GND_24V=GND_24V INT_AN_MOD=DRV1_AN_MOD INT_DIG_MOD=DRV1_DIG_MOD MEAS_CUR=DRV1_CUR ON/OFF=DRV1_ON OVERCUR=DRV1_ERR1 OVERHEAT=DRV1_ERR2 SEL_AN_MOD=DRV1_SEL_AN SEL_DIG_MOD=DRV1_SEL_DIG
A7: designators end in A7; ports +3.3V=+3.3V +3.3VA=+3.3VA +5V=+5V +5VA=+5VA +24V=+24V AGND=AGND EXT_AN_MOD=EXT_AN_MOD EXT_DIG_MOD=EXT_DIG_MOD GND=GND GND_24V=GND_24V INT_AN_MOD=DRV2_AN_MOD INT_DIG_MOD=DRV2_DIG_MOD MEAS_CUR=DRV2_CUR ON/OFF=DRV2_ON OVERCUR=DRV2_ERR1 OVERHEAT=DRV2_ERR2 SEL_AN_MOD=DRV2_SEL_AN SEL_DIG_MOD=DRV2_SEL_DIG

### Notes on the sheet
- +12V
- GND
- ON/OFF
- DIG_MOD
- (near XP5) MEASURED CURRENT
- AN_MOD
- OVERCURRENT
- OVERHEAT
- Подп. и дата
- Инв. № дубл.
- Взам. инв. №
- Инв. № подл.
- Изм.
- Лист
- № докум.
- Подп.
- Дата
- Копировал
- Формат А3
- (in symbol Connector-8) Конт.; Цепь
- (in symbol LD2981ABU50TR) *STU
- (in symbol TME) DC/DC

### Library data of the parts
C48 = Capacitor: as C40 on sheet Power_supply; Value: 10нФ; Document: *
C49 C51 C52 C54 C55 C58 C60-C62 C65-C67 = Capacitor: as C4 on sheet Main; Value: 0,1мкФ; Document: *
C50 = Capacitor_Polar: Model: TECAP, 10 мкФ, 35 В, тип C, 10%; Value: 10мкФх35B; Document: *; Manufacturer: *
C53 = Capacitor_Polar: Model: TECAP, 10 мкФ, 25 В, тип B, 10%; Value: 10мкФх25B; Document: *; Manufacturer: *
C56 C57 C63 C64 C68 C69 = Capacitor: as C94 on sheet Hardwiring; Value: 100пФ; Document: *
C59 = Capacitor: as C105 on sheet Hardwiring; Value: 0,33мкФ; Document: *
DA8 DA10 = SN74LVC1G3157: Manufacturer: Texas Instruments; Model: SN74LVC1G3157DBV; Document: *
DA9 DA13 DA14 = LMC7101: Manufacturer: Texas Instruments; Model: LMC7101BIM5; Document: *
DA11 = TME: Manufacturer: Traco Power; Model: TME 2412S; Document: *
DA12 = LD2981ABU50TR: Manufacturer: STMicroelectronics; Model: L78L05ABUTR; Document: *
DD7 = ADUM1402: Manufacturer: Analog Devices; Model: ADUM1402CRW; Document: *
R31 R34-R39 R42 R43 = Resistor: as R9 on sheet Main; Value: 10к; Document: *
R32 = Resistor: Manufacturer: Yageo; Model: RC0603FR-076K49L; Value: 6,49к; Document: *
R33 = Resistor: Manufacturer: Yageo; Model: RC0603FR-0715KL; Value: 15к; Document: *
R40 R44 = Resistor: Manufacturer: Yageo; Model: RC0603FR-0724K9L; Value: 24,9к; Document: *
R41 R45 = Resistor: as R99 on sheet Hardwiring; Value: 16,5к; Document: *
U1 U2 = ACPL-C87: Manufacturer: Broadcom; Model: ACPL-C87A-500E
XP5 = Connector-8: Manufacturer: JST; Model: B8B-PHDSS; Document: *

## Sheet Guide_laser.SchDoc
size 420 x 297 mm; Address1: Address1; Address2: Address2; Address3: Address3; Address4: Address4; DocumentNumber: *Э3; SheetNumber: 6; SheetTotal: 11; DocumentType: Схема электрическая *
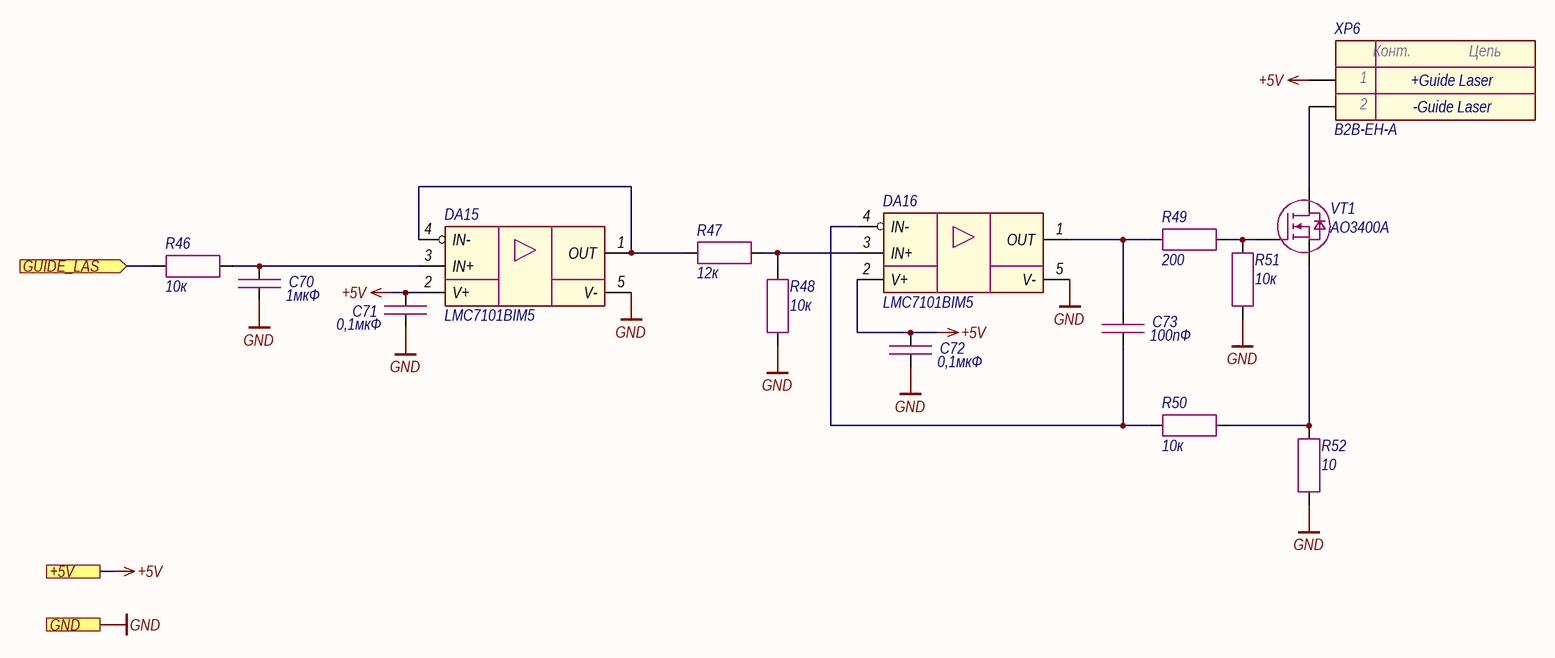
[diagram p8: Guide_laser.SchDoc]

### Parts
C70  1мкФ  [CAP_0603]
C71  0,1мкФ  [CAP_0603]
C72  0,1мкФ  [CAP_0603]
C73  100пФ  [CAP_0603]
DA15  LMC7101BIM5  [SOT-23-5]
DA16  LMC7101BIM5  [SOT-23-5]
R46  10к  [RES_0603]
R47  12к  [RES_0603]
R48  10к  [RES_0603]
R49  200  [RES_0603]
R50  10к  [RES_0603]
R51  10к  [RES_0603]
R52  10  [RES_1210]
VT1  AO3400A  [SOT-23-3]
XP6  B2B-EH-A  [B2B-EH-A]

### Ports
+5V (see Main[2A], LD_driver[1D]), GND (see Main[2A], Ethernet[3D], Fiber_interlock[2C], Flow_sensor[2C], Hardwiring[3D], Indication[1C], LD_driver[1D], Power_supply[1D]), GUIDE_LAS (in, see Main[3A])

### Nets
+5V: C71.1 C72.1 DA15.2(V+) DA16.2(V+) XP6.1 ; port +5V
GND: C70.2 C71.2 C72.2 DA15.5(V-) DA16.5(V-) R48.2 R51.1 R52.1 ; port GND
GUIDE_LAS: R46.1 ; port GUIDE_LAS
NetC70_1: C70.1 DA15.3(IN+) R46.2
NetC73_1: C73.1 DA16.1(OUT) R49.1
NetC73_2: C73.2 DA16.4(IN-) R50.1
NetDA15_1: DA15.1(OUT) DA15.4(IN-) R47.1
NetDA16_3: DA16.3(IN+) R47.2 R48.1
NetR49_2: R49.2 R51.2 VT1.1(G)
NetR50_2: R50.2 R52.2 VT1.2(S)
NetVT1_3: VT1.3(D) XP6.2

### Notes on the sheet
- +Guide Laser
- -Guide Laser
- Подп. и дата
- Инв. № дубл.
- Взам. инв. №
- Инв. № подл.
- Изм.
- Лист
- № докум.
- Подп.
- Дата
- Копировал
- Формат А3
- (in symbol Connector-2) Конт.; Цепь

### Library data of the parts
C70 = Capacitor: as C109 on sheet Hardwiring; Value: 1мкФ; Document: *
C71 C72 = Capacitor: as C4 on sheet Main; Value: 0,1мкФ; Document: *
C73 = Capacitor: as C94 on sheet Hardwiring; Value: 100пФ; Document: *
DA15 DA16 = LMC7101: Manufacturer: Texas Instruments; Model: LMC7101BIM5; Document: *
R46 R48 R50 R51 = Resistor: as R9 on sheet Main; Value: 10к; Document: *
R47 = Resistor: as R70 on sheet Ethernet; Value: 12к; Document: *
R49 = Resistor: as R11 on sheet Main; Value: 200; Document: *
R52 = Resistor: Manufacturer: Yageo; Model: RC1210FR-0710RL; Value: 10; Document: *
VT1 = MOSFET N-channel: Manufacturer: UMW; Model: AO3400A; Document: *
XP6 = Connector-2: Manufacturer: JST; Model: B2B-EH-A; Document: *

## Sheet Fiber_interlock.SchDoc
size 420 x 297 mm; Address1: Address1; Address2: Address2; Address3: Address3; Address4: Address4; DocumentNumber: *Э3; SheetNumber: 8; SheetTotal: 11; DocumentType: Схема электрическая *
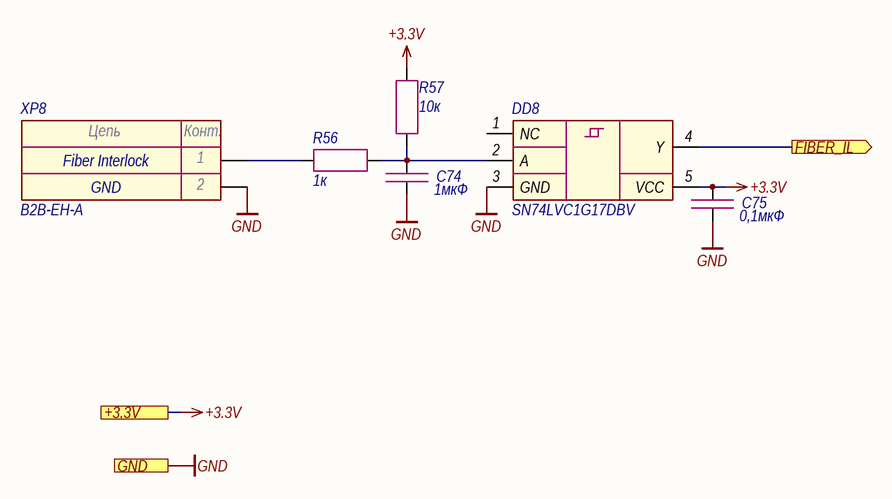
[diagram p9: Fiber_interlock.SchDoc]

### Parts
C74  1мкФ  [CAP_0603]
C75  0,1мкФ  [CAP_0603]
DD8  SN74LVC1G17DBV  [SOT-23-5]
R56  1к  [RES_0603]
R57  10к  [RES_0603]
XP8  B2B-EH-A  [B2B-EH-A]

### Ports
+3.3V (see Main[2A], Ethernet[3D], Flow_sensor[2C], Hardwiring[3D], LD_driver[1D], Power_supply[1D]), FIBER_IL (out, see Main[3A]), GND (see Main[2A], Ethernet[3D], Flow_sensor[2C], Guide_laser[1C], Hardwiring[3D], Indication[1C], LD_driver[1D], Power_supply[1D])

### Nets
+3.3V: C75.1 DD8.5(VCC) R57.2 ; port +3.3V
GND: C74.2 C75.2 DD8.3(GND) XP8.2 ; port GND
FIBER_IL: DD8.4(Y) ; port FIBER_IL
NetC74_1: C74.1 DD8.2(A) R56.2 R57.1
NetR56_1: R56.1 XP8.1

Not connected (* = marked no-connect by the designer): DD8 1(NC)

### Notes on the sheet
- (near XP8) Fiber Interlock
- GND
- Подп. и дата
- Инв. № дубл.
- Взам. инв. №
- Инв. № подл.
- Изм.
- Лист
- № докум.
- Подп.
- Дата
- Копировал
- Формат А3
- (in symbol Connector-2) Цепь; Конт.

### Library data of the parts
C74 = Capacitor: as C109 on sheet Hardwiring; Value: 1мкФ; Document: *
C75 = Capacitor: as C4 on sheet Main; Value: 0,1мкФ; Document: *
DD8 = SN74LVC1G17: Manufacturer: Texas Instruments; Model: SN74LVC1G17DBV; Document: *
R56 = Resistor: as R64 on sheet Ethernet; Value: 1к; Document: *
R57 = Resistor: as R9 on sheet Main; Value: 10к; Document: *
XP8 = Connector-2: Manufacturer: JST; Model: B2B-EH-A; Document: *

## Sheet Flow_sensor.SchDoc
size 420 x 297 mm; Address1: Address1; Address2: Address2; Address3: Address3; Address4: Address4; DocumentNumber: *Э3; SheetNumber: 11; SheetTotal: 11; DocumentType: Схема электрическая *
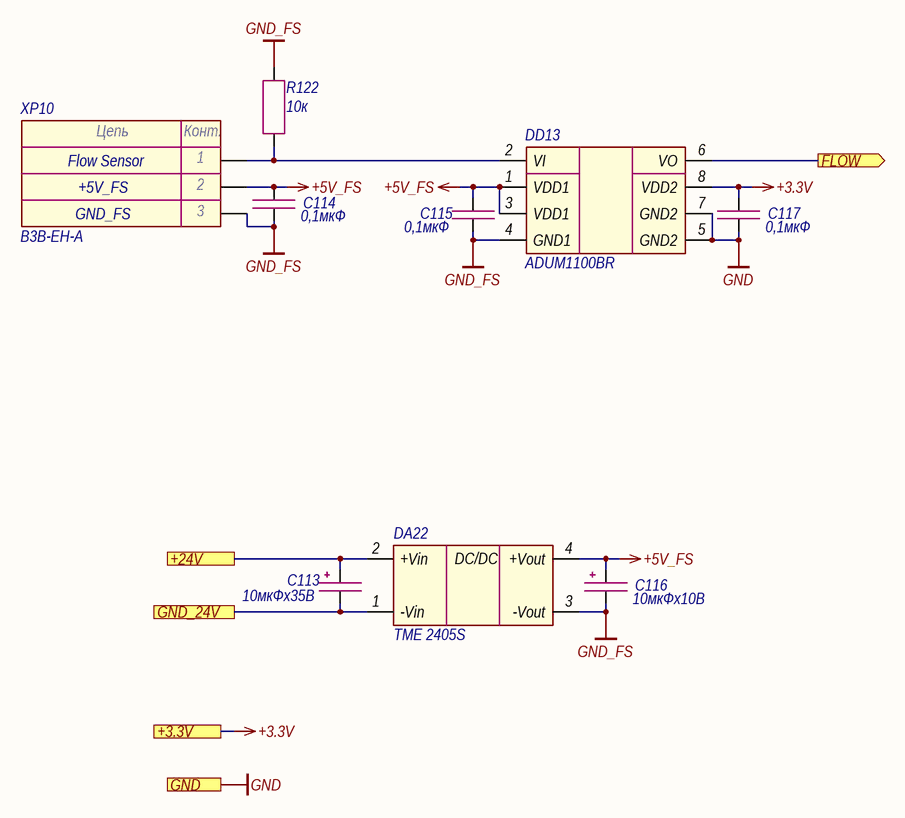
[diagram p10: Flow_sensor.SchDoc]

### Parts
C113  10мкФх35B  [CAP_C]
C114  0,1мкФ  [CAP_0603]
C115  0,1мкФ  [CAP_0603]
C116  10мкФх10B  [CAP_A]
C117  0,1мкФ  [CAP_0603]
DA22  TME 2405S  [TME (SIP-4)]
DD13  ADUM1100BR  [SOIC-8]
R122  10к  [RES_0603]
XP10  B3B-EH-A  [B3B-EH-A]

### Ports
+3.3V (see Main[3C], Ethernet[3D], Fiber_interlock[2C], Hardwiring[3D], LD_driver[1D], Power_supply[1D]), +24V (see Main[2C], Hardwiring[3C], Indication[1C], LD_driver[1D], Power_supply[1D]), FLOW (out, see Main[3C]), GND (see Main[3C], Ethernet[3D], Fiber_interlock[2C], Guide_laser[1C], Hardwiring[3D], Indication[1C], LD_driver[1D], Power_supply[1D]), GND_24V (see Main[2C], Hardwiring[3C], Indication[1C], LD_driver[1D], Power_supply[1D])

### Nets
+3.3V: C117.1 DD13.8(VDD2) ; port +3.3V
+5V_FS: C114.1 C115.1 C116.1 DA22.4(+Vout) DD13.1(VDD1) DD13.3(VDD1) XP10.2
+24V: C113.1 DA22.2(+Vin) ; port +24V
GND: C117.2 DD13.5(GND2) DD13.7(GND2) ; port GND
GND_24V: C113.2 DA22.1(-Vin) ; port GND_24V
GND_FS: C114.2 C115.2 C116.2 DA22.3(-Vout) DD13.4(GND1) R122.2 XP10.3
FLOW: DD13.6(VO) ; port FLOW
NetDD13_2: DD13.2(VI) R122.1 XP10.1

### Notes on the sheet
- +5V_FS
- Flow Sensor
- GND_FS
- Подп. и дата
- Инв. № дубл.
- Взам. инв. №
- Инв. № подл.
- Изм.
- Лист
- № докум.
- Подп.
- Дата
- Копировал
- Формат А3
- (in symbol Connector-3) Цепь; Конт.
- (in symbol TME) DC/DC

### Library data of the parts
C113 = Capacitor_Polar: Model: TECAP, 10 мкФ, 35 В, тип C, 10%; Value: 10мкФх35B; Document: *; Manufacturer: *
C114 C115 C117 = Capacitor: as C4 on sheet Main; Value: 0,1мкФ; Document: *
C116 = Capacitor_Polar: Model: TECAP, 10 мкФ, 10 В, тип A, 10%; Value: 10мкФх10B; Document: *; Manufacturer: *
DA22 = TME: Manufacturer: Traco Power; Model: TME 2405S; Document: *
DD13 = ADUM1100: Manufacturer: Analog Devices; Model: ADUM1100BR; Document: *
R122 = Resistor: as R9 on sheet Main; Value: 10к; Document: *
XP10 = Connector-3: Manufacturer: JST; Model: B3B-EH-A; Document: *